# EAGLE design NuTubeAmp_1_0_1 (EAGLE 6.3)
DATABASE: ../../PARTSDB.txt

## Sheet 1 of 3
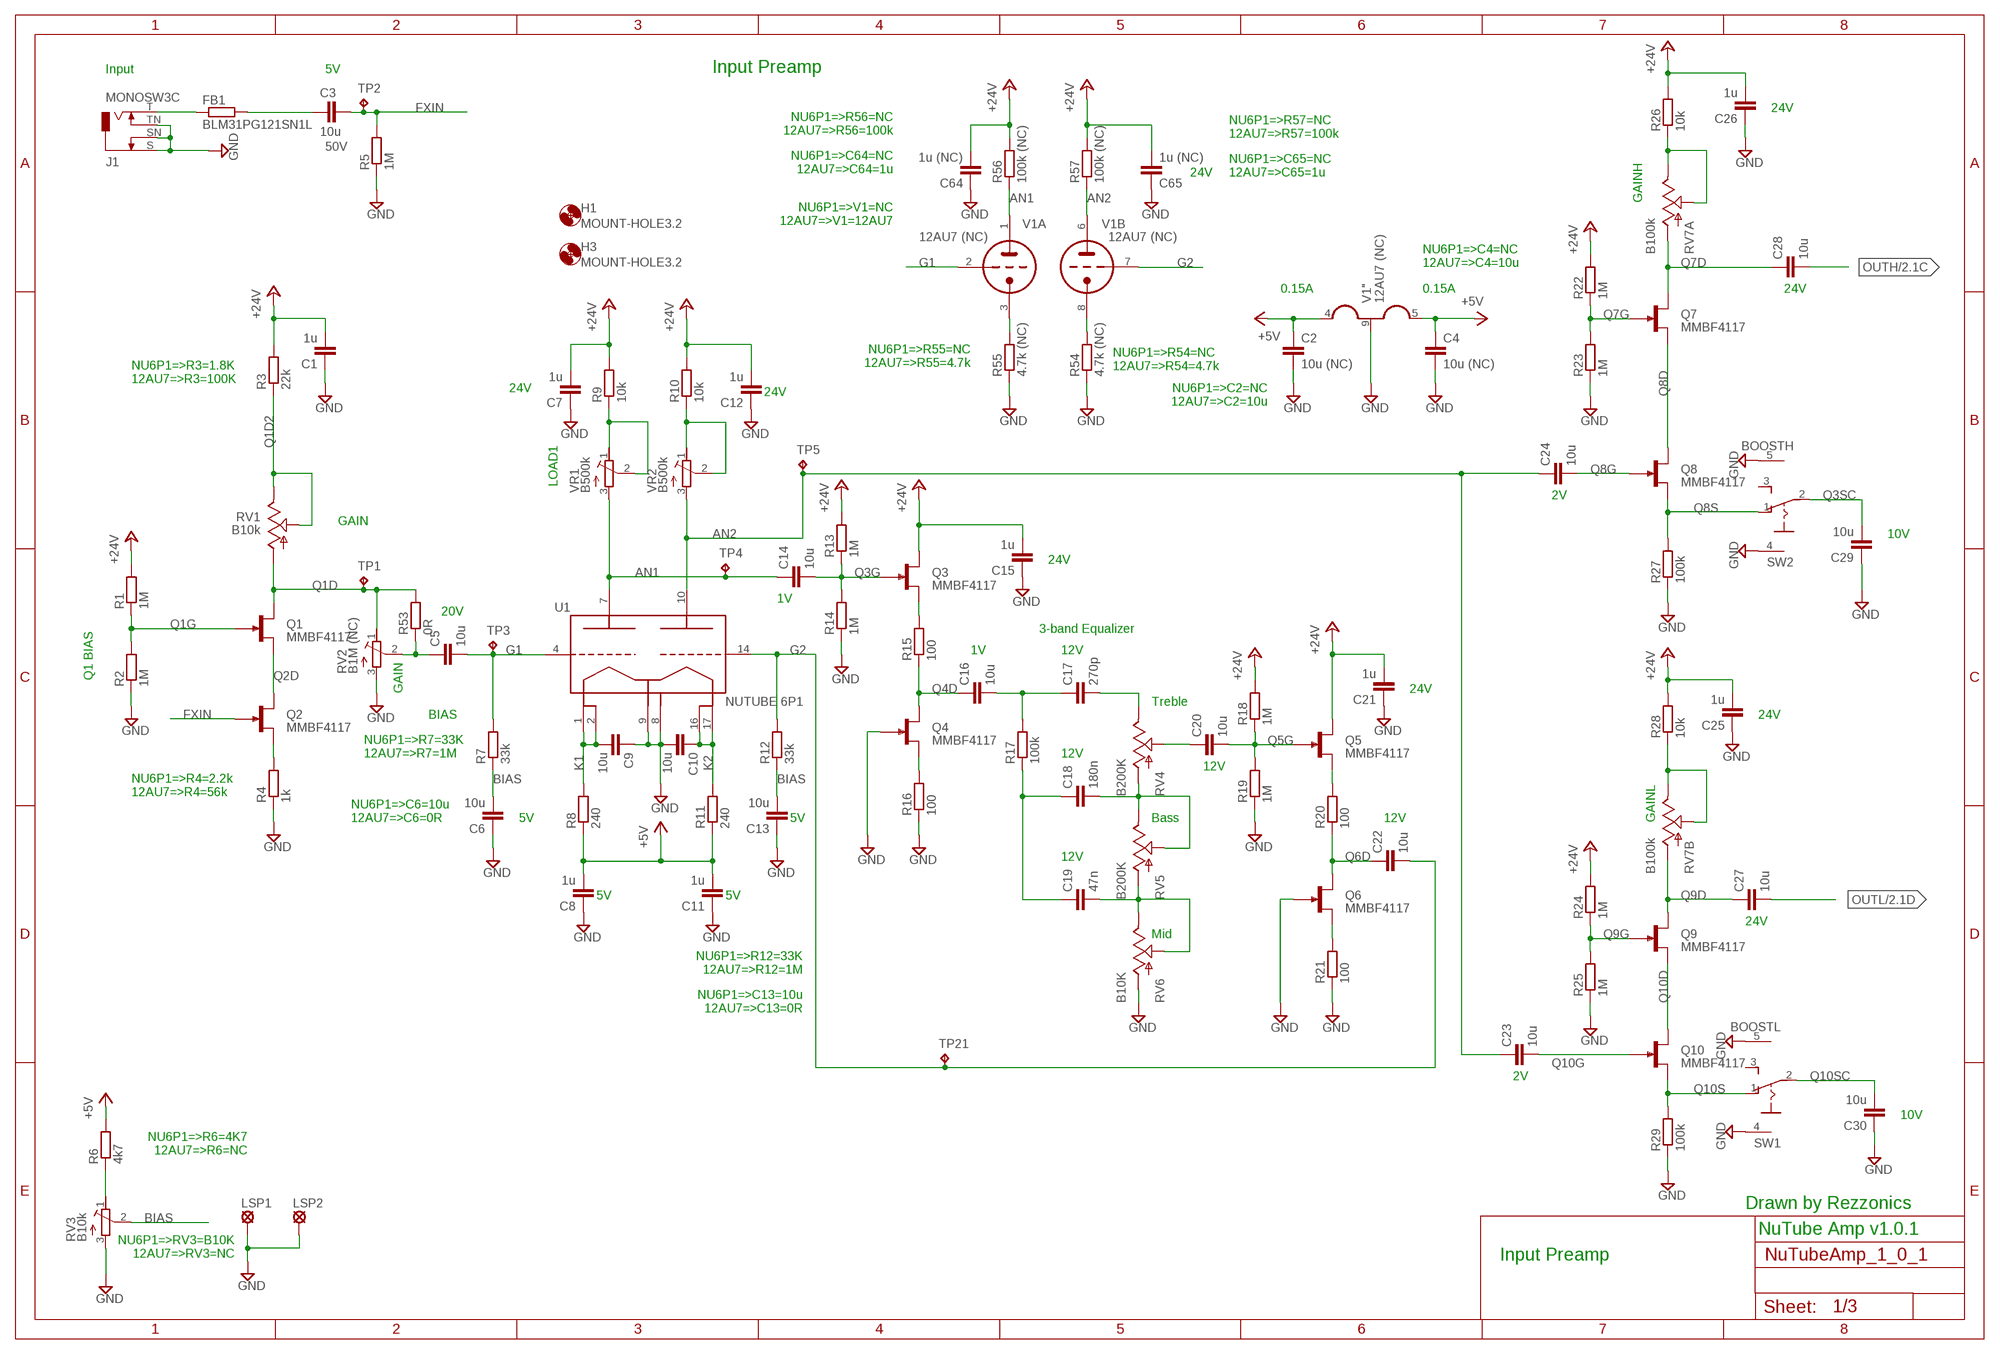
[diagram p0: schematic, sheet 1]

### Parts
C1  1u  C-EUC0603K  [C0603K]
C2  10u (NC)  C-EUC0805K  [C0805K]
C3  10u  C-EUC0805K  [C0805K]
C4  10u (NC)  C-EUC0805K  [C0805K]
C5  10u  C-EUC0805K  [C0805K]
C6  10u  C-EUC0805K  [C0805K]
C7  1u  C-EUC0603K  [C0603K]
C8  1u  C-EUC0603K  [C0603K]
C9  10u  C-EUC0805K  [C0805K]
C10  10u  C-EUC0805K  [C0805K]
C11  1u  C-EUC0603K  [C0603K]
C12  1u  C-EUC0603K  [C0603K]
C13  10u  C-EUC0805K  [C0805K]
C14  10u  C-EUC0805K  [C0805K]
C15  1u  C-EUC0603K  [C0603K]
C16  10u  C-EUC0805K  [C0805K]
C17  270p  C-EUC0402K  [C0402K]
C18  180n  C-EUC0603K  [C0603K]
C19  47n  C-EUC0402K  [C0402K]
C20  10u  C-EUC0805K  [C0805K]
C21  1u  C-EUC0603K  [C0603K]
C22  10u  C-EUC0805K  [C0805K]
C23  10u  C-EUC0805K  [C0805K]
C24  10u  C-EUC0805K  [C0805K]
C25  1u  C-EUC0603K  [C0603K]
C26  1u  C-EUC0603K  [C0603K]
C27  10u  C-EUC0805K  [C0805K]
C28  10u  C-EUC0805K  [C0805K]
C29  10u  C-EUC0805K  [C0805K]
C30  10u  C-EUC0805K  [C0805K]
C64  1u (NC)  C-EUC0603K  [C0603K]
C65  1u (NC)  C-EUC0603K  [C0603K]
FB1  BLM31PG121SN1L  R-EU_R1206  [R1206]
H1  MOUNT-HOLE3.2  [3,2]
H3  MOUNT-HOLE3.2  [3,2]
J1  MONOSW3C  [NEUTRIK-NMJ4HCD2]
LSP1  LSP13  [LSP13]
LSP2  LSP13  [LSP13]
Q1  MMBF4117  MMBF4117SOT23  [SOT23]
Q2  MMBF4117  MMBF4117SOT23  [SOT23]
Q3  MMBF4117  MMBF4117SOT23  [SOT23]
Q4  MMBF4117  MMBF4117SOT23  [SOT23]
Q5  MMBF4117  MMBF4117SOT23  [SOT23]
Q6  MMBF4117  MMBF4117SOT23  [SOT23]
Q7  MMBF4117  MMBF4117SOT23  [SOT23]
Q8  MMBF4117  MMBF4117SOT23  [SOT23]
Q9  MMBF4117  MMBF4117SOT23  [SOT23]
Q10  MMBF4117  MMBF4117SOT23  [SOT23]
R1  1M  R-EU_R0402  [R0402]
R2  1M  R-EU_R0402  [R0402]
R3  22k  R-EU_R0402  [R0402]
R4  1k  R-EU_R0402  [R0402]
R5  1M  R-EU_R0402  [R0402]
R6  4k7  R-EU_R0402  [R0402]
R7  33k  R-EU_R0402  [R0402]
R8  240  R-EU_R0603  [R0603]
R9  10k  R-EU_R0402  [R0402]
R10  10k  R-EU_R0402  [R0402]
R11  240  R-EU_R0603  [R0603]
R12  33k  R-EU_R0402  [R0402]
R13  1M  R-EU_R0402  [R0402]
R14  1M  R-EU_R0402  [R0402]
R15  100  R-EU_R0402  [R0402]
R16  100  R-EU_R0402  [R0402]
R17  100k  R-EU_R0402  [R0402]
R18  1M  R-EU_R0402  [R0402]
R19  1M  R-EU_R0402  [R0402]
R20  100  R-EU_R0402  [R0402]
R21  100  R-EU_R0402  [R0402]
R22  1M  R-EU_R0402  [R0402]
R23  1M  R-EU_R0402  [R0402]
R24  1M  R-EU_R0402  [R0402]
R25  1M  R-EU_R0402  [R0402]
R26  10k  R-EU_R0402  [R0402]
R27  100k  R-EU_R0402  [R0402]
R28  10k  R-EU_R0402  [R0402]
R29  100k  R-EU_R0402  [R0402]
R53  0R  R-EU_R0402  [R0402]
R54  4.7k (NC)  R-EU_R0402  [R0402]
R55  4.7k (NC)  R-EU_R0402  [R0402]
R56  100k (NC)  R-EU_R0402  [R0402]
R57  100k (NC)  R-EU_R0402  [R0402]
RV1  B10k  POT3310Y  [3310Y]
RV2  B1M (NC)  R-TRIMM3314G  [RTRIM3314G]
RV3  B10k  R-TRIMM3314G  [RTRIM3314G]
RV4  B200K  POT3310Y  [3310Y]
RV5  B200K  POT3310Y  [3310Y]
RV6  B10K  POT3310Y  [3310Y]
RV7  B100k  DPOT1  [3310H]
SW1  BOOSTL  SPDT  [MHS122K]
SW2  BOOSTH  SPDT  [MHS122K]
TP1  TPTP10R  [TP10R]
TP2  TPTP10R  [TP10R]
TP3  TPTP10R  [TP10R]
TP4  TPTP10R  [TP10R]
TP5  TPTP10R  [TP10R]
TP21  TPTP10R  [TP10R]
U1  NUTUBE 6P1  NUTUBE_6P1_1  [NUTUBE_6P1_1]
V1  12AU7 (NC)  12AU7-PVT9  [VT9]
VR1  B500k  R-TRIMM3314G  [RTRIM3314G]
VR2  B500k  R-TRIMM3314G  [RTRIM3314G]

### Nets
+5V [PWR]: C2.1 C4.1 C8.2 C11.2 R6.2 R8.1 R11.1 V1.4(":H1) V1.5(":H3) ; also sheet 2,3
+24V [PWR]: C1.2 C7.2 C12.2 C15.2 C21.2 C25.2 C26.2 C64.2 C65.2 Q3.1(D) Q5.1(D) R1.2 R3.2 R9.2 R10.2 R13.2 R18.2 R22.2 R24.2 R26.2 R28.2 R56.2 R57.2 ; also sheet 2,3
AN1: C14.1 R56.1 TP4.TP U1.7(A1_7) V1.1(A:TA) VR1.3(A)
AN2: C23.1 C24.1 R57.1 TP5.TP U1.10(A2_10) V1.6(B:TA) VR2.3(A)
BAST: C18.2 RV4.P$1(A) RV5.P$2(S) RV5.P$3(E)
BIAS: C6.2 C13.2 R7.1 R12.1 RV3.2(S)
EQIN: C16.2 C17.1 R17.2
EQOUT: C20.1 RV4.P$2(S)
FXIN: C3.2 Q2.2(G) R5.2 TP2.TP
G1: C5.2 R7.2 TP3.TP U1.4(G1_4) V1.2(A:TG)
G2: C22.2 R12.2 TP21.TP U1.14(G2_14) V1.7(B:TG)
G2TOP: R55.2 V1.3(A:TK)
G3TOP: R26.1 RV7.P$2(A:S) RV7.P$3(A:E)
G4TOP: R28.1 RV7.P$5(B:S) RV7.P$6(B:E)
GND [PWR]: C1.1 C2.2 C4.2 C6.1 C7.1 C8.1 C9.1 C10.2 C11.1 C12.1 C13.1 C15.1 C21.1 C25.1 C26.1 C29.1 C30.1 C64.1 C65.1 J1.S J1.SN J1.TN LSP1.MP LSP2.MP Q4.2(G) Q6.2(G) R2.1 R4.1 R5.1 R14.1 R16.1 R19.1 R21.1 R23.1 R25.1 R27.1 R29.1 R54.1 R55.1 RV2.3(A) RV3.3(A) RV6.P$1(A) SW1.4(G1) SW1.5(G2) SW2.4(G1) SW2.5(G2) U1.8(GND_8) U1.9(F2_9) V1.9(":H2) ; also sheet 2,3
GTOP: C5.1 R53.1 RV2.2(S)
K1: C9.2 R8.2 U1.1(F1_1) U1.2(F1_2)
K2: C10.1 R11.2 U1.16(F3_16) U1.17(F3_17)
MIDT: C19.2 RV5.P$1(A) RV6.P$2(S) RV6.P$3(E)
N$1: FB1.1 J1.T
N$2: C3.1 FB1.2
N$5: Q3.3(S) R15.2
N$21: R6.1 RV3.1(E)
N$22: R54.2 V1.8(B:TK)
N$29: C18.1 C19.1 R17.1
OUTH: C28.2 ; also sheet 2
OUTL: C27.2 ; also sheet 2
Q1D: Q1.1(D) R53.2 RV1.P$1(A) RV2.1(E) TP1.TP
Q1D2: R3.1 RV1.P$2(S) RV1.P$3(E)
Q1G: Q1.2(G) R1.1 R2.2
Q1S: Q2.3(S) R4.2
Q1S1: Q4.3(S) R16.2
Q1S2: Q6.3(S) R21.2
Q2D: Q1.3(S) Q2.1(D)
Q3G: C14.2 Q3.2(G) R13.1 R14.2
Q3SC: C29.2 SW2.2(P)
Q4D: C16.1 Q4.1(D) R15.1
Q5G: C20.2 Q5.2(G) R18.1 R19.2
Q5S: Q5.3(S) R20.2
Q6D: C22.1 Q6.1(D) R20.1
Q7D: C28.1 Q7.1(D) RV7.P$1(A:A)
Q7G: Q7.2(G) R22.1 R23.2
Q8D: Q7.3(S) Q8.1(D)
Q8G: C24.2 Q8.2(G)
Q8S: Q8.3(S) R27.2 SW2.1(O)
Q9D: C27.1 Q9.1(D) RV7.P$4(B:A)
Q9G: Q9.2(G) R24.1 R25.2
Q10D: Q9.3(S) Q10.1(D)
Q10G: C23.2 Q10.2(G)
Q10S: Q10.3(S) R29.2 SW1.1(O)
Q10SC: C30.2 SW1.2(P)
RL1: R9.1 VR1.1(E) VR1.2(S)
RL2: R10.1 VR2.1(E) VR2.2(S)
TBT: C17.2 RV4.P$3(E)
Unconnected: SW1.3(S) SW2.3(S)

### Notes on the sheet
- Input | 5V | Input Preamp
- NU6P1=>R56=NC
  12AU7=>R56=100k
- 24V
- NU6P1=>R57=NC
  12AU7=>R57=100k
- NU6P1=>C64=NC
  12AU7=>C64=1u
- 24V
- NU6P1=>C65=NC
  12AU7=>C65=1u
- NU6P1=>V1=NC
  12AU7=>V1=12AU7
- GAINH
- NU6P1=>C4=NC
  12AU7=>C4=10u
- 0.15A | 0.15A | 24V
- NU6P1=>R55=NC
  12AU7=>R55=4.7k
- NU6P1=>R54=NC
  12AU7=>R54=4.7k
- NU6P1=>R3=1.8K
  12AU7=>R3=100K
- 24V
- NU6P1=>C2=NC
  12AU7=>C2=10u
- 24V
- LOAD1
- 2V
- GAIN
- 10V
- 24V
- 1V
- 20V
- 3-band Equalizer
- 1V | 12V
- Q1 BIAS
- GAIN | 24V
- Treble
- BIAS | 24V
- NU6P1=>R7=33K
  12AU7=>R7=1M
- 12V
- 12V
- NU6P1=>R4=2.2k
  12AU7=>R4=56k
- NU6P1=>C6=10u
  12AU7=>C6=0R
- 5V | 5V | Bass | 12V | GAINL
- 12V
- 5V | 5V
- 24V
- Mid
- NU6P1=>R12=33K
  12AU7=>R12=1M
- NU6P1=>C13=10u
  12AU7=>C13=0R
- 2V
- 10V
- NU6P1=>R6=4K7
  12AU7=>R6=NC
- Drawn by Rezzonics
- NU6P1=>RV3=B10K
  12AU7=>RV3=NC
- NuTube Amp v1.0.1
- Input Preamp

## Sheet 2 of 3
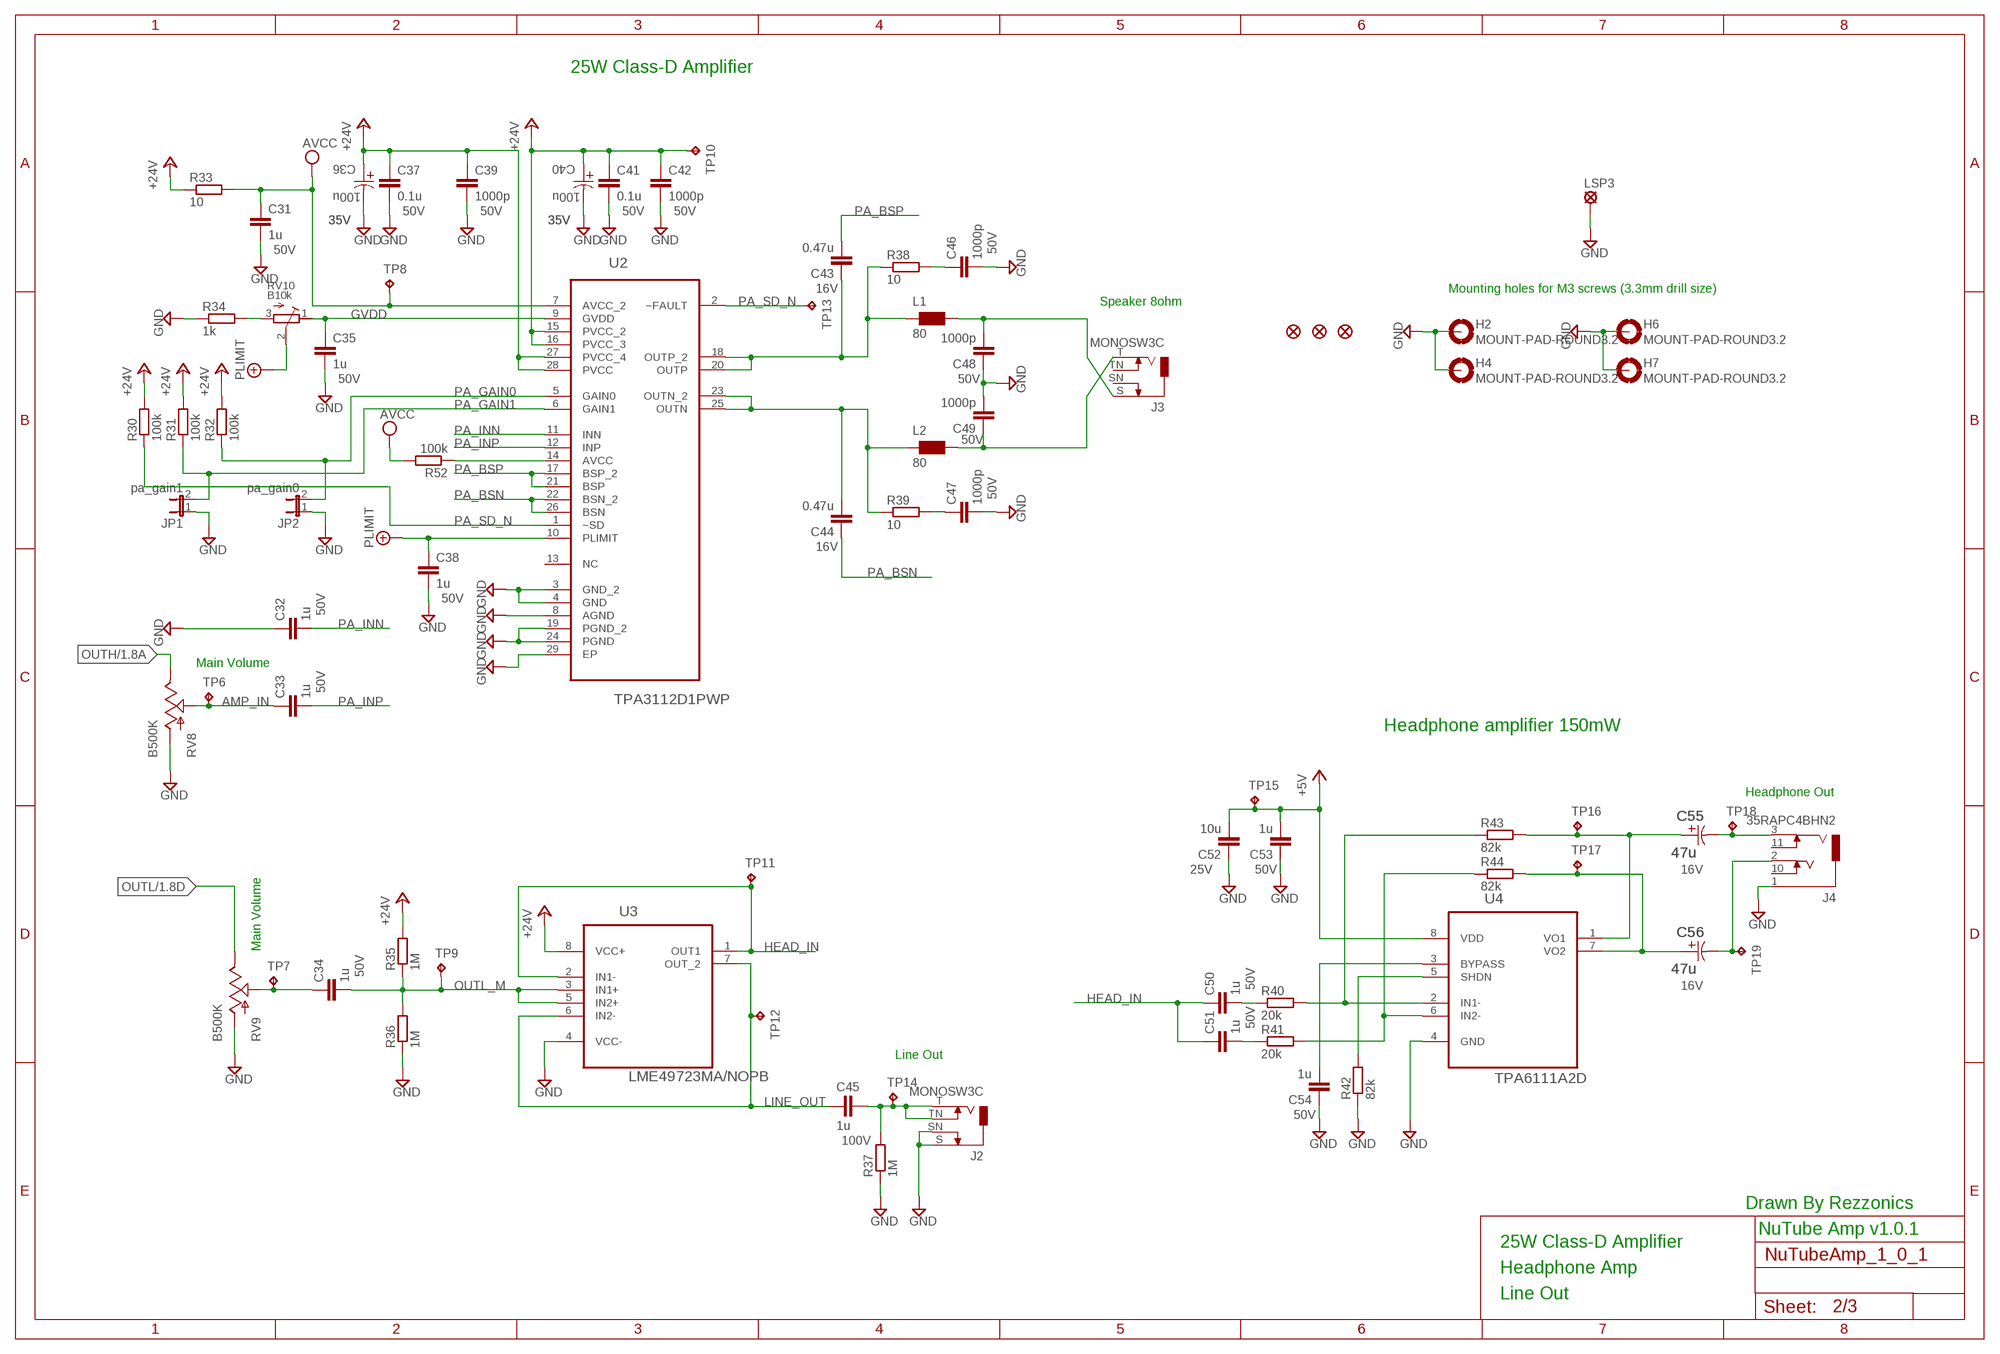
[diagram p1: schematic, sheet 2]

### Parts
C31  1u  C-EUC0603K  [C0603K]
C32  1u  C-EUC0603K  [C0603K]
C33  1u  C-EUC0603K  [C0603K]
C34  1u  C-EUC0603K  [C0603K]
C35  1u  C-EUC0603K  [C0603K]
C36  100u  EEE-HAE101XAP-CASE-D8  [CAPAE660X800N]
C37  0.1u  C-EUC0603K  [C0603K]
C38  1u  C-EUC0603K  [C0603K]
C39  1000p  C-EUC0603K  [C0603K]
C40  100u  EEE-HAE101XAP-CASE-D8  [CAPAE660X800N]
C41  0.1u  C-EUC0603K  [C0603K]
C42  1000p  C-EUC0603K  [C0603K]
C43  0.47u  C-EUC0603K  [C0603K]
C44  0.47u  C-EUC0603K  [C0603K]
C45  1u  C-EUC0603K  [C0603K]
C46  1000p  C-EUC0603K  [C0603K]
C47  1000p  C-EUC0603K  [C0603K]
C48  1000p  C-EUC0603K  [C0603K]
C49  1000p  C-EUC0603K  [C0603K]
C50  1u  C-EUC0603K  [C0603K]
C51  1u  C-EUC0603K  [C0603K]
C52  10u  C-EUC0805K  [C0805K]
C53  1u  C-EUC0603K  [C0603K]
C54  1u  C-EUC0603K  [C0603K]
C55  47u  EEE-HBC470UAR-CASE-C  [CAPAE530X610N]
C56  47u  EEE-HBC470UAR-CASE-C  [CAPAE530X610N]
H2  MOUNT-PAD-ROUND3.2  [3,2-PAD]
H4  MOUNT-PAD-ROUND3.2  [3,2-PAD]
H6  MOUNT-PAD-ROUND3.2  [3,2-PAD]
H7  MOUNT-PAD-ROUND3.2  [3,2-PAD]
J2  MONOSW3C  [NEUTRIK-NMJ4HCD2]
J3  MONOSW3C  [NEUTRIK-NMJ4HCD2]
J4  35RAPC4BHN2  [35RAPC4BHN2]
JP1  pa_gain1  JUMPER-2PTH  [1X02]
JP2  pa_gain0  JUMPER-2PTH  [1X02]
JP3  FIDUCIAL1X2.5  [FIDUCIAL-1X2.5]
JP4  FIDUCIAL1X2.5  [FIDUCIAL-1X2.5]
JP5  FIDUCIAL1X2.5  [FIDUCIAL-1X2.5]
L1  80  WE-CBF_0805  [0805]
L2  80  WE-CBF_0805  [0805]
LSP3  LSP13  [LSP13]
R30  100k  R-EU_R0603  [R0603]
R31  100k  R-EU_R0603  [R0603]
R32  100k  R-EU_R0603  [R0603]
R33  10  R-EU_R0603  [R0603]
R34  1k  R-EU_R0603  [R0603]
R35  1M  R-EU_R0402  [R0402]
R36  1M  R-EU_R0402  [R0402]
R37  1M  R-EU_R0402  [R0402]
R38  10  R-EU_R0603  [R0603]
R39  10  R-EU_R0603  [R0603]
R40  20k  R-EU_R0603  [R0603]
R41  20k  R-EU_R0603  [R0603]
R42  82k  R-EU_R0603  [R0603]
R43  82k  R-EU_R0603  [R0603]
R44  82k  R-EU_R0603  [R0603]
R52  100k  R-EU_R0603  [R0603]
RV8  B500K  POT3310Y  [3310Y]
RV9  B500K  POT3310Y  [3310Y]
RV10  B10k  R-TRIMM3314G  [RTRIM3314G]
TP6  TPTP10R  [TP10R]
TP7  TPTP10R  [TP10R]
TP8  TPTP10R  [TP10R]
TP9  TPTP10R  [TP10R]
TP10  TPTP10R  [TP10R]
TP11  TPTP10R  [TP10R]
TP12  TPTP10R  [TP10R]
TP13  TPTP10R  [TP10R]
TP14  TPTP10R  [TP10R]
TP15  TPTP10R  [TP10R]
TP16  TPTP10R  [TP10R]
TP17  TPTP10R  [TP10R]
TP18  TPTP10R  [TP10R]
TP19  TPTP10R  [TP10R]
U2  TPA3112D1PWP  [SOP65P640X120-29N]
U3  LME49723MA/NOPB  TL972ID  [SOIC127P600X175-8N]
U4  TPA6111A2D  [SOIC127P600X175-8N]

### Nets
+5V [PWR]: C52.2 C53.2 TP15.TP U4.8(VDD) ; also sheet 1,3
+24V [PWR]: C36.1 C37.1 C39.1 C40.1 C41.1 C42.1 R30.2 R31.2 R32.2 R33.1 R35.2 TP10.TP U2.15(PVCC_2) U2.16(PVCC_3) U2.27(PVCC_4) U2.28(PVCC) U3.8(VCC+) ; also sheet 1,3
+UB [PWR]: C38.1 RV10.2(S) U2.10(PLIMIT) ; supply symbol labelled PLIMIT
AMP_IN: C33.1 RV8.P$2(S) TP6.TP
GND [PWR]: C31.2 C32.1 C35.2 C36.2 C37.2 C38.2 C39.2 C40.2 C41.2 C42.2 C46.2 C47.2 C48.1 C49.2 C52.1 C53.1 C54.1 H2.B3,2(MOUNT) H4.B3,2(MOUNT) H6.B3,2(MOUNT) H7.B3,2(MOUNT) J2.S J2.SN J4.1(S) JP1.1 JP2.1 LSP3.MP R34.1 R36.1 R37.1 R42.1 RV8.P$1(A) RV9.P$1(A) U2.3(GND_2) U2.4(GND) U2.8(AGND) U2.19(PGND_2) U2.24(PGND) U2.29(EP) U3.4(VCC-) U4.4(GND) ; also sheet 1,3
GVDD [PWR]: C35.1 RV10.1(E) U2.9(GVDD)
HEAD_IN: C50.1 C51.1 TP11.TP U3.1(OUT1) U3.2(IN1-)
LINE_OUT: C45.1 TP12.TP U3.6(IN2-) U3.7(OUT_2)
N$3: R40.2 R43.1 U4.2(IN1-)
N$8: R52.1 U2.14(AVCC)
N$10: R41.2 R44.1 U4.6(IN2-)
N$12: C55.1 R43.2 TP16.TP U4.1(VO1)
N$13: C34.1 RV9.P$2(S) TP7.TP
N$14: C56.1 R44.2 TP17.TP U4.7(VO2)
N$15: C50.2 R40.1
N$16: C51.2 R41.1
N$17: C54.2 U4.3(BYPASS)
N$18: R42.2 U4.5(SHDN)
N$19: C55.2 J4.3(R) TP18.TP
N$20: C56.2 J4.2(T) TP19.TP
N$64: C45.2 J2.T J2.TN R37.2 TP14.TP
N$65: C46.1 R38.2
N$66: C47.1 R39.2
N$67: R34.2 RV10.3(A)
N$68: C49.1 J3.T L2.2
N$70: C48.2 J3.S L1.2
N$71: C43.1 L1.1 R38.1 U2.18(OUTP_2) U2.20(OUTP)
N$72: C44.2 L2.1 R39.1 U2.23(OUTN_2) U2.25(OUTN)
OUTH: RV8.P$3(E) ; also sheet 1
OUTL: RV9.P$3(E) ; also sheet 1
OUTL_M: C34.2 R35.1 R36.2 TP9.TP U3.3(IN1+) U3.5(IN2+)
PA_BSN: C44.1 U2.22(BSN_2) U2.26(BSN)
PA_BSP: C43.2 U2.17(BSP_2) U2.21(BSP)
PA_GAIN0: JP2.2 R32.1 U2.5(GAIN0)
PA_GAIN1: JP1.2 R31.1 U2.6(GAIN1)
PA_INN: C32.2 U2.11(INN)
PA_INP: C33.2 U2.12(INP)
PA_SD_N: R30.1 TP13.TP U2.1(~SD) U2.2(~FAULT)
VCC: C31.1 R33.2 R52.2 TP8.TP U2.7(AVCC_2) ; supply symbol labelled AVCC
Unconnected: J3.SN J3.TN J4.10(TN) J4.11(RN) U2.13(NC)

### Notes on the sheet
- 25W Class-D Amplifier
- Mounting holes for M3 screws (3.3mm drill size)
- Speaker 8ohm
- Main Volume
- Headphone amplifier 150mW
- Headphone Out
- Main Volume
- Line Out
- Drawn By Rezzonics
- NuTube Amp v1.0.1
- 25W Class-D Amplifier
- Headphone Amp
- Line Out

## Sheet 3 of 3
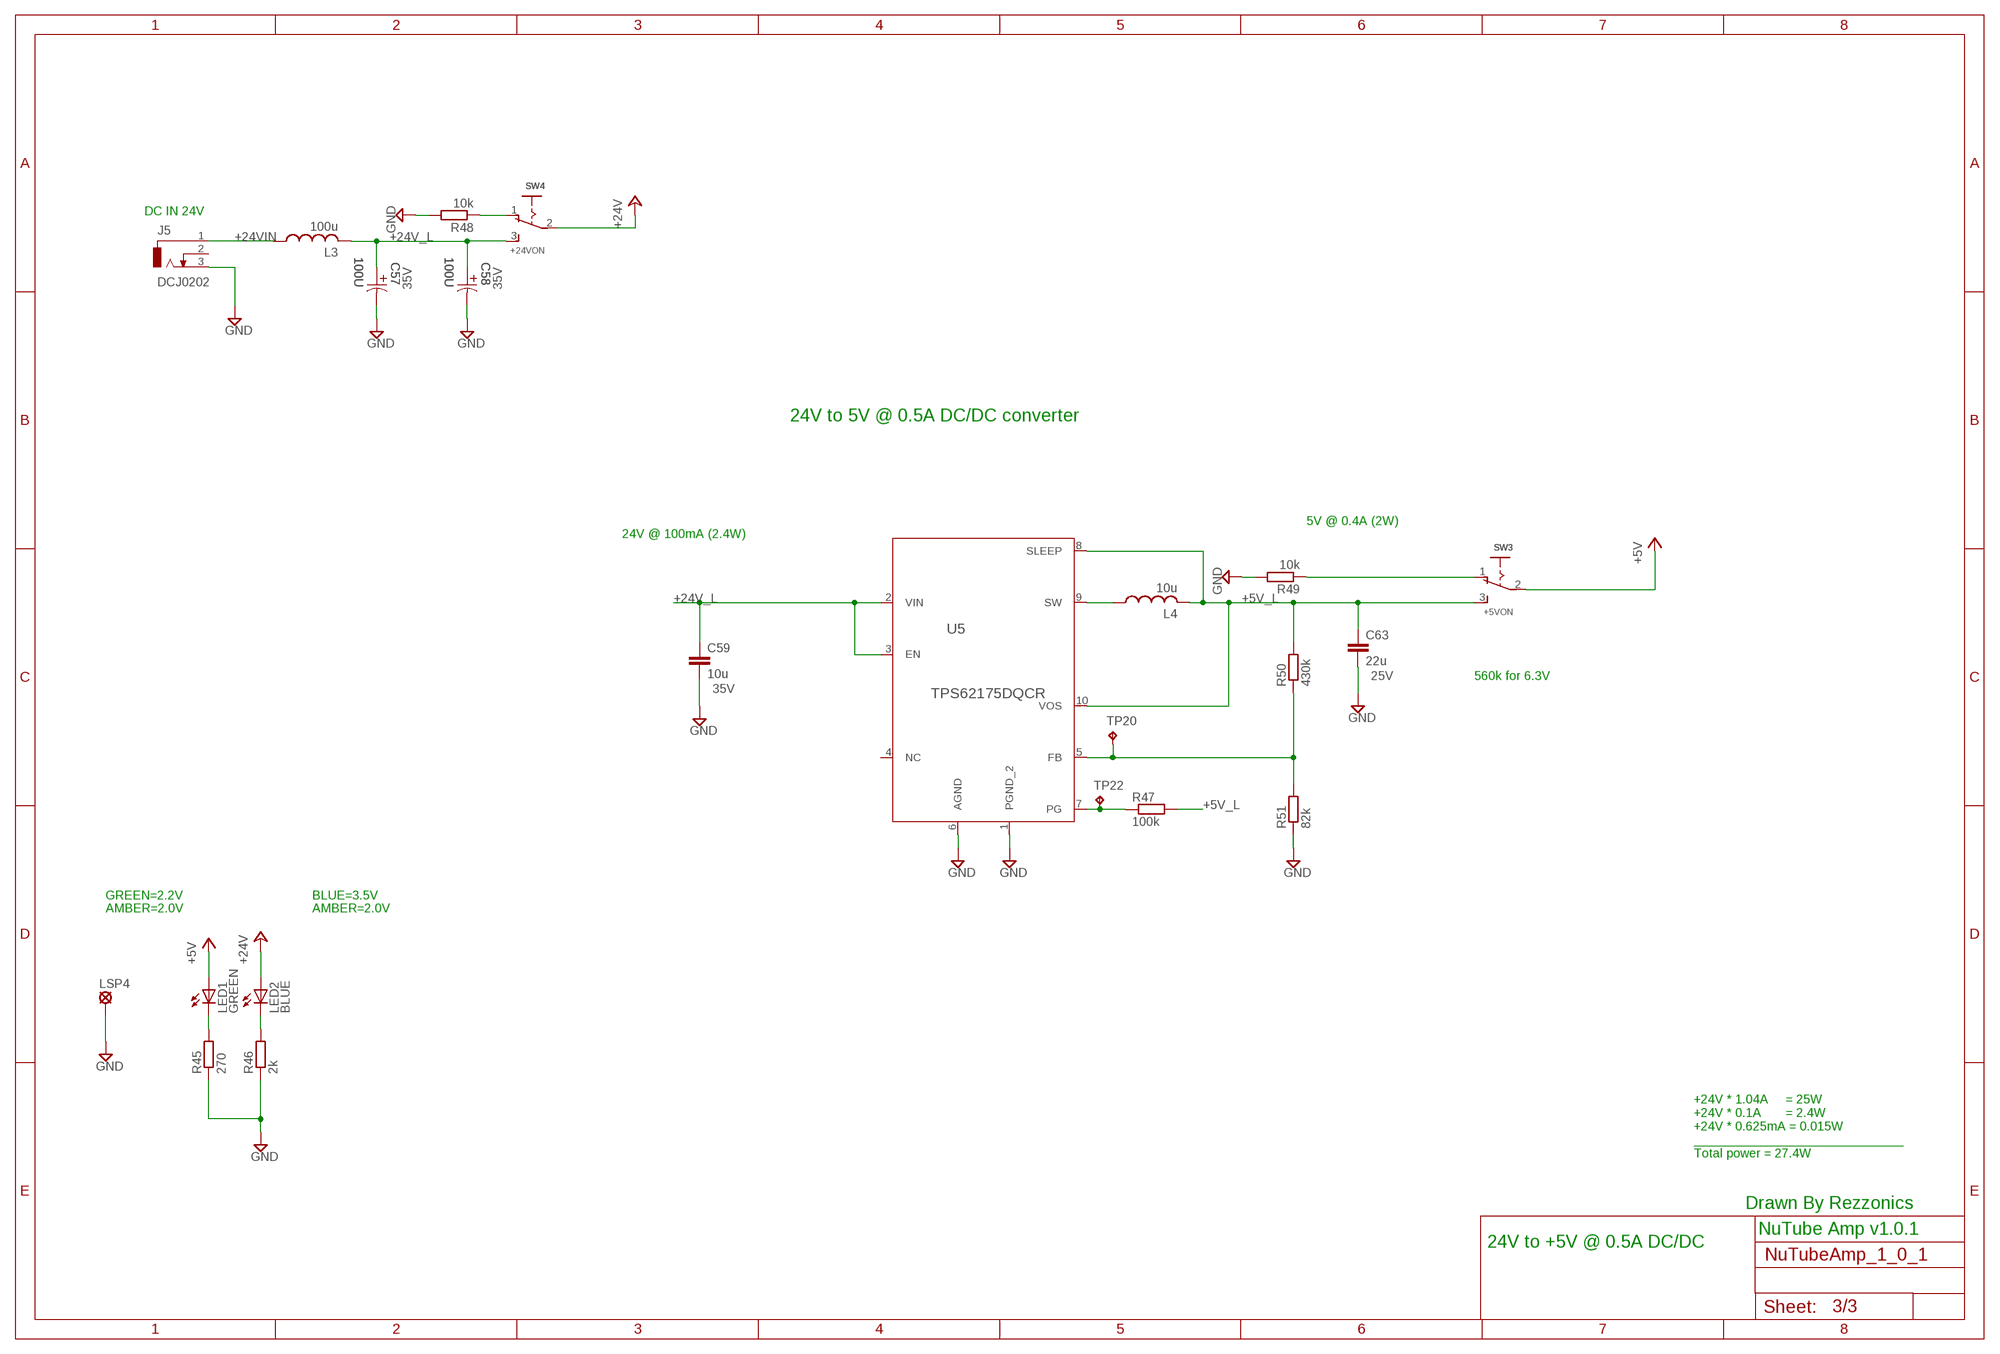
[diagram p2: schematic, sheet 3]

### Parts
C57  100U  EEE-HAV101XAP-CASE-D8  [CAPAE660X800N]
C58  100U  EEE-HAV101XAP-CASE-D8  [CAPAE660X800N]
C59  10u  C-EUC0805K  [C0805K]
C63  22u  C-EUC0805K  [C0805K]
J5  DCJ0202  [DCJ0202]
L3  100u  SRN1060  [SRN1060]
L4  10u  SRN4018  [SRN4018]
LED1  GREEN  LED5MM  [LED5MM]
LED2  BLUE  LED5MM  [LED5MM]
LSP4  LSP13  [LSP13]
R45  270  R-EU_R0603  [R0603]
R46  2k  R-EU_R0603  [R0603]
R47  100k  R-EU_R0402  [R0402]
R48  10k  R-EU_R0603  [R0603]
R49  10k  R-EU_R0603  [R0603]
R50  430k  R-EU_R0402  [R0402]
R51  82k  R-EU_R0402  [R0402]
SW3  +5VON  SPDT1G  [GH39P0]
SW4  +24VON  SPDT1G  [GH39P0]
TP20  TPTP10R  [TP10R]
TP22  TPTP10R  [TP10R]
U5  TPS62175DQCR  [R-PWSON-N10]

### Nets
+5V [PWR]: LED1.A SW3.2(P) ; also sheet 1,2
+5V_L [PWR]: C63.1 L4.2 R47.2 R50.2 SW3.3(S) U5.8(SLEEP) U5.10(VOS)
+24V [PWR]: LED2.A SW4.2(P) ; also sheet 1,2
+24V_L [PWR]: C57.1 C58.1 C59.1 L3.2 SW4.3(S) U5.2(VIN) U5.3(EN)
+24VIN: J5.1 L3.1
GND [PWR]: C57.2 C58.2 C59.2 C63.2 J5.3 LSP4.MP R45.1 R46.1 R48.2 R49.2 R51.1 U5.1(PGND_2) U5.6(AGND) ; also sheet 1,2
N$4: R47.1 TP22.TP U5.7(PG)
N$6: R48.1 SW4.1(O)
N$7: R49.1 SW3.1(O)
N$23 [PWR]: L4.1 U5.9(SW)
N$90: LED1.K(C) R45.2
N$102: LED2.K(C) R46.2
VCC3: R50.1 R51.2 TP20.TP U5.5(FB)
Unconnected: J5.2 U5.4(NC)

### Notes on the sheet
- DC IN 24V
- 24V to 5V @ 0.5A DC/DC converter
- 5V @ 0.4A (2W)
- 24V @ 100mA (2.4W)
- 560k for 6.3V
- GREEN=2.2V | BLUE=3.5V
- AMBER=2.0V | AMBER=2.0V
- +24V * 1.04A     = 25W
  +24V * 0.1A       = 2.4W
  +24V * 0.625mA = 0.015W
  ____________________________
  Total power = 27.4W
- Drawn By Rezzonics
- NuTube Amp v1.0.1
- 24V to +5V @ 0.5A DC/DC

## Library data of the parts
C1 C7 C8 C11 C12 C15 C21 C25 C26 C64 C65 = rcl:C-EU: CAPACITOR, European symbol; MPN: C1608X5R1H105K080AB
C2 C4-C6 C9 C10 C13 C14 C16 C20 C22-C24 C27-C30 = rcl:C-EU: CAPACITOR, European symbol; MPN: GRM21BR6YA106KE43L
C3 = rcl:C-EU: CAPACITOR, European symbol; MPN: GRM21BR6YA106KE43L; VOLT: 50V
C17 = rcl:C-EU: CAPACITOR, European symbol; MPN: GRM1555C1H271JA01D; VOLT: 50V
C18 = rcl:C-EU: CAPACITOR, European symbol; MPN: GRM188R71C184KA01D; VOLT: 16V
C19 = rcl:C-EU: CAPACITOR, European symbol; MPN: GRM155R71H473KE14D; VOLT: 16V
C31-C35 C38 C50 C51 C53 C54 = rcl:C-EU: CAPACITOR, European symbol; MPN: C1608X5R1H105K080AB; VOLT: 50V
C36 C40 = Panasonic-EEE-EEV-EEF-ECQ:EEE-: Aluminum Electrolytic Capacitors,Surface Mount Type; MPN: EEE-1VA101XP; OC_FARNELL: 2284687; OC_MOUSER: 667-EEE-1VA101XP; OC_NEWARK: 53W3698; SUPPLIER: PANASONIC; TOLERANCE: ±20 %; VALUE: 100UF; VOLT: 35V; VOLTAGERATING: 35V
C37 C41 = rcl:C-EU: CAPACITOR, European symbol; MPN: GRM188R71H104KA93D; VOLT: 50V
C39 C42 C46-C49 = rcl:C-EU: CAPACITOR, European symbol; MPN: GRM1885C1H102FA01D; VOLT: 50V
C43 C44 = rcl:C-EU: CAPACITOR, European symbol; MPN: GRM188R71C474KA88D; VOLT: 16V
C45 = rcl:C-EU: CAPACITOR, European symbol; MPN: C1608X5R1H105K080AB; VOLT: 100V
C52 = rcl:C-EU: CAPACITOR, European symbol; MPN: GRM21BR6YA106KE43L; VOLT: 25V
C55 C56 = Panasonic-EEE-EEV-EEF-ECQ:EEE-: Aluminum Electrolytic Capacitors,Surface Mount Type; MPN: EEE-HBC470UAR; OC_FARNELL: 2284699; OC_NEWARK: 53W3709; RATEDVOLTAGE: 16V; SUPPLIER: PANASONIC; TOLERANCE: ±20 %; VALUE: 47UF; VOLT: 16V
C57 C58 = Panasonic-EEE-EEV-EEF-ECQ:EEE-: Aluminum Electrolytic Capacitors,Surface Mount Type; MPN: EEE-1VA101XP; OC_FARNELL: 2284690; OC_NEWARK: 53W3701; SUPPLIER: PANASONIC; TOLERANCE: ±20 %; VALUE: 100UF; VOLTAGERATING: 35V
C59 = rcl:C-EU: CAPACITOR, European symbol; MPN: GRM21BR6YA106KE43L; VOLT: 35V
C63 = rcl:C-EU: CAPACITOR, European symbol; MPN: C2012X5R1V226M125AC; VOLT: 25V
FB1 = rcl:R-EU_: RESISTOR, European symbol; MPN: BLM31PG121SN1L
H1 H3 = holes:MOUNT-HOLE: MOUNTING HOLE with drill center marker; MPN: *
H2 H4 H6 H7 = holes:MOUNT-PAD-ROUND: MOUNTING PAD, round; MPN: *
J1-J3 = audio jacks 0.25 inch:MONOSW3C: 1/4" mono jack, switched, with chrome ferrule and straight PCB pins, mounting nut included; MPN: NMJ4HCD2
J4 = audio jacks 3.5mm:35RAPC4BHN2: 3.5MM PC horizontal mount Jack, stereo, non-threaded bushing PN#: Switchcraft 35RAPC4BHN2 Mouser PN# 502-35RAPC4BHN2; MPN: 35RAPC4BHN2
J5 = con-jack:DCJ0202: DC POWER JACK Source: DCJ0202.pdf; MPN: PJ-202A; OC_FARNELL: unknown; OC_NEWARK: unknown
JP1 JP2 = SparkFun:JUMPER-2: Jumper Basic 0.1" spaced jumper. Use with breakaway headers.; MPN: 77311-401-36LF
JP3-JP5 = SparkFun:FIDUCIAL: Fiducial Alignment Points Various fiducial points for machine vision alignment.; MPN: *
L1 L2 = wuerth-elektronik:WE-CBF: SMD EMI Suppression Ferrite Beads - excellent anti-EMI properties - low DCR - impedances till 3000 ohms - rated current up to 6 A; MPN: HI0805R800R-10
L3 = rezzonics:SRN1060: SRN10160 <http://www.bourns.com/docs/Product-Datasheets/SRN1060.pdf>; MPN: SRN1060-101M
L4 = rezzonics:SRN4018: SRN4018 <http://www.bourns.com/docs/Product-Datasheets/SRN4018.pdf>; MPN: SRN4018-100M
LED1 = led:LED: LED OSRAM: - CHIPLED LG R971, LG N971, LY N971, LG Q971, LY Q971, LO R971, LY R971 LH N974, LH R974 LS Q976, LO Q976, LY Q976 LO Q996 - Hyper CHIPLED LW Q18S LB Q993, LB Q99A, LB R99A - SideLED LS A670, LO A670, LY A670, LG A670, LP A670 LB A673, LV A673, LT A673, LW A673 LH A674 LY A675 LS A676, LA A676, LO A676, LY A676, LW A676 LS A679, LY A679, LG A679 - Hyper Micro SIDELED® LS Y876, LA Y876, LO Y876, LY Y876 LT Y87S - SmartLED LW L88C, LW L88S LB L89C, LB L89S, LG L890 LS L89K, LO L89K, LY L89K LS L896, LA L896, LO L896, LY L896 - TOPLED LS T670, LO T670, LY T670, LG T670, LP T670 LSG T670, LSP T670, LSY T670, LOP T670, LYG T670 LG T671, LOG T671, LSG T671 LB T673, LV T673, LT T673, LW T673 LH T674 LS T676, LA T676, LO T676, LY T676, LB T676, LH T676, LSB T676, LW T676 LB T67C, LV T67C, LT T67C, LS T67K, LO T67K, LY T67K, LW E67C LS E67B, LA E67B, LO E67B, LY E67B, LB E67C, LV E67C, LT E67C LW T67C LS T679, LY T679, LG T679 LS T770, LO T770, LY T770, LG T770, LP T770 LB T773, LV T773, LT T773, LW T773 LH T774 LS E675, LA E675, LY E675, LS T675 LS T776, LA T776, LO T776, LY T776, LB T776 LHGB T686 LT T68C, LB T68C - Hyper Mini TOPLED® LB M676 - Mini TOPLED Santana® LG M470 LS M47K, LO M47K, LY M47K Source: http://www.osram.convergy.de LUXEON: - LUMILED® LXK2-PW12-R00, LXK2-PW12-S00, LXK2-PW14-U00, LXK2-PW14-V00 LXK2-PM12-R00, LXK2-PM12-S00, LXK2-PM14-U00 LXK2-PE12-Q00, LXK2-PE12-R00, LXK2-PE12-S00, LXK2-PE14-T00, LXK2-PE14-U00 LXK2-PB12-K00, LXK2-PB12-L00, LXK2-PB12-M00, LXK2-PB14-N00, LXK2-PB14-P00, LXK2-PB14-Q00 LXK2-PR12-L00, LXK2-PR12-M00, LXK2-PR14-Q00, LXK2-PR14-R00 LXK2-PD12-Q00, LXK2-PD12-R00, LXK2-PD12-S00 LXK2-PH12-R00, LXK2-PH12-S00 LXK2-PL12-P00, LXK2-PL12-Q00, LXK2-PL12-R00 Source: www.luxeon.com KINGBRIGHT: KA-3528ASYC Source: www.kingbright.com; MPN: SSL-LX5093GD
LED2 = led:LED: LED OSRAM: - CHIPLED LG R971, LG N971, LY N971, LG Q971, LY Q971, LO R971, LY R971 LH N974, LH R974 LS Q976, LO Q976, LY Q976 LO Q996 - Hyper CHIPLED LW Q18S LB Q993, LB Q99A, LB R99A - SideLED LS A670, LO A670, LY A670, LG A670, LP A670 LB A673, LV A673, LT A673, LW A673 LH A674 LY A675 LS A676, LA A676, LO A676, LY A676, LW A676 LS A679, LY A679, LG A679 - Hyper Micro SIDELED® LS Y876, LA Y876, LO Y876, LY Y876 LT Y87S - SmartLED LW L88C, LW L88S LB L89C, LB L89S, LG L890 LS L89K, LO L89K, LY L89K LS L896, LA L896, LO L896, LY L896 - TOPLED LS T670, LO T670, LY T670, LG T670, LP T670 LSG T670, LSP T670, LSY T670, LOP T670, LYG T670 LG T671, LOG T671, LSG T671 LB T673, LV T673, LT T673, LW T673 LH T674 LS T676, LA T676, LO T676, LY T676, LB T676, LH T676, LSB T676, LW T676 LB T67C, LV T67C, LT T67C, LS T67K, LO T67K, LY T67K, LW E67C LS E67B, LA E67B, LO E67B, LY E67B, LB E67C, LV E67C, LT E67C LW T67C LS T679, LY T679, LG T679 LS T770, LO T770, LY T770, LG T770, LP T770 LB T773, LV T773, LT T773, LW T773 LH T774 LS E675, LA E675, LY E675, LS T675 LS T776, LA T776, LO T776, LY T776, LB T776 LHGB T686 LT T68C, LB T68C - Hyper Mini TOPLED® LB M676 - Mini TOPLED Santana® LG M470 LS M47K, LO M47K, LY M47K Source: http://www.osram.convergy.de LUXEON: - LUMILED® LXK2-PW12-R00, LXK2-PW12-S00, LXK2-PW14-U00, LXK2-PW14-V00 LXK2-PM12-R00, LXK2-PM12-S00, LXK2-PM14-U00 LXK2-PE12-Q00, LXK2-PE12-R00, LXK2-PE12-S00, LXK2-PE14-T00, LXK2-PE14-U00 LXK2-PB12-K00, LXK2-PB12-L00, LXK2-PB12-M00, LXK2-PB14-N00, LXK2-PB14-P00, LXK2-PB14-Q00 LXK2-PR12-L00, LXK2-PR12-M00, LXK2-PR14-Q00, LXK2-PR14-R00 LXK2-PD12-Q00, LXK2-PD12-R00, LXK2-PD12-S00 LXK2-PH12-R00, LXK2-PH12-S00 LXK2-PL12-P00, LXK2-PL12-Q00, LXK2-PL12-R00 Source: www.luxeon.com KINGBRIGHT: KA-3528ASYC Source: www.kingbright.com; MPN: SSL-LX5093USBD
LSP1-LSP4 = solpad:LSP13: SOLDER PAD drill 1.3 mm, distributor Buerklin, 12H562; MPN: 1249
Q1-Q10 = rezzonics:MMBF4117: N-CHANNEL FET MMBF4117 <https://www.fairchildsemi.com/datasheets/MM/MMBF4117.pdf>; MPN: MMBF4117
R1 R2 R5 R13 R14 R18 R19 R22-R25 R35-R37 = resistor:R-EU_: RESISTOR, European symbol; MPN: ERJ-2RKF1004X
R3 = resistor:R-EU_: RESISTOR, European symbol; MPN: ERJ-2RKF1801X
R4 = resistor:R-EU_: RESISTOR, European symbol; MPN: ERJ-2RKF2201X
R6 R54 R55 = resistor:R-EU_: RESISTOR, European symbol; MPN: ERJ-2RKF4701X
R7 R12 = resistor:R-EU_: RESISTOR, European symbol; MPN: ERJ-2RKF3302X
R8 R11 = rcl:R-EU_: RESISTOR, European symbol; MPN: ERJ-3EKF2400V
R9 R10 R26 R28 = resistor:R-EU_: RESISTOR, European symbol; MPN: ERJ-2RKF1002X
R15 R16 R20 R21 = resistor:R-EU_: RESISTOR, European symbol; MPN: ERJ-2RKF1000X
R17 R27 R29 R47 R56 R57 = resistor:R-EU_: RESISTOR, European symbol; MPN: ERJ-2RKF1003X
R30-R32 R52 = rcl:R-EU_: RESISTOR, European symbol; MPN: ERJ-3EKF1003V
R33 R38 R39 = rcl:R-EU_: RESISTOR, European symbol; MPN: CRCW060310R0FKEAHP
R34 = rcl:R-EU_: RESISTOR, European symbol; MPN: ERJ-3EKF1001V
R40 R41 = resistor:R-EU_: RESISTOR, European symbol; MPN: ERJ-3EKF2002V
R42-R44 = resistor:R-EU_: RESISTOR, European symbol; MPN: ERJ-3EKF8202V
R45 = rcl:R-EU_: RESISTOR, European symbol; MPN: ERJ-PA3F2700V
R46 = rcl:R-EU_: RESISTOR, European symbol; MPN: ERJ-PA3F2001V
R48 R49 = rcl:R-EU_: RESISTOR, European symbol; MPN: CR0603-FX-1002HLF
R50 = resistor:R-EU_: RESISTOR, European symbol; MPN: ERJ-2GEJ434X
R51 = resistor:R-EU_: RESISTOR, European symbol; MPN: ERJ-2RKF8202X
R53 = resistor:R-EU_: RESISTOR, European symbol; MPN: ERJ-2GE0R00X
RV1 RV6 = rezzonics:POT; MPN: 3310Y-001-103L
RV2 = rcl:R-TRIMM: Trimm resistor; MPN: 3314G-1-105E
RV3 RV10 = rcl:R-TRIMM: Trimm resistor; MPN: 3314G-2-103E
RV4 RV5 = rezzonics:POT; MPN: 3310Y-001-204L
RV7 = rezzonics:DPOT1: 3310H 9mm dual gang pot Datasheet <http://www.bourns.com/docs/Product-Datasheets/3310.pdf>; MPN: 3310H-001-104L
RV8 RV9 = rezzonics:POT; MPN: 3310Y-001-504L
SW1 SW2 = rezzonics:SPDT: SPDT SLIDING SWITCH 4mm spacing through hole, vertical SPDT slide switch APEM MHS122K <http://www.apem.com/files/apem/brochures/MHS_MINI_SLIDE.pdf>; MPN: MHS122K
SW3 SW4 = rezzonics:SPDT1: SPDT1; MPN: GH36P010001
TP1-TP22 = testpad:TP: Test pad; MPN: *
U1 = rezzonics:NUTUBE_6P1: NUTUBE 6P1 Twin Triode Datasheet <http://nutube.us/downloads/Nutube_Datasheet_31.pdf>; MPN: *
U2 = Texas Instruments_By_element14_Batch_1:TPA3112D1PWP: CLASS-D AUDIO POWER AMPLIFIER; MPN: TPA3112D1PWP; OC_FARNELL: 1781260; OC_NEWARK: 32R7817; PACKAGE: HTSSOP-28; SUPPLIER: Texas Instruments
U3 = Texas Instruments_By_element14_Batch_1:TL972ID: OPERATIONAL AMPLIFIERS; MPN: LME49723MA/NOPB; OC_FARNELL: 1755226; OC_NEWARK: 52M6085; PACKAGE: SOIC-8; SUPPLIER: TI
U4 = Texas Instruments_By_element14_Batch_1:TPA6111A2D: AUDIO POWER AMPLIFIER; MPN: TPA6111A2D; OC_FARNELL: 8456593; OC_NEWARK: 38K8607; PACKAGE: SOIC-8; SUPPLIER: TI
U5 = rezzonics:TPS62175DQCR; DATASHEETURL: httpwww.ti.comproducttps62175; FREQUENCY: 1000000.0; IMAX: 0.5; MANUFACTURER_NAME: Texas Instruments; MANUFACTURER_PART_NUMBER: TPS62175DQCR; MKTG_PACKAGE: TPS62175; MPN: TPS62175DQCR; NSID: TPS62175DQCR; PACKAGE: TPS62175; VENDOR: Texas Instruments
V1 = tubes:12AU7-P; MPN: *
VR1 VR2 = rcl:R-TRIMM: Trimm resistor; MPN: 3314G-1-504E

## Net classes
0 default: width 0.25 mm, drill 0.5 mm, clearance 0.254 mm
1 PWR: width 0.4 mm, drill 0.5 mm, clearance 0.254 mm

## Board
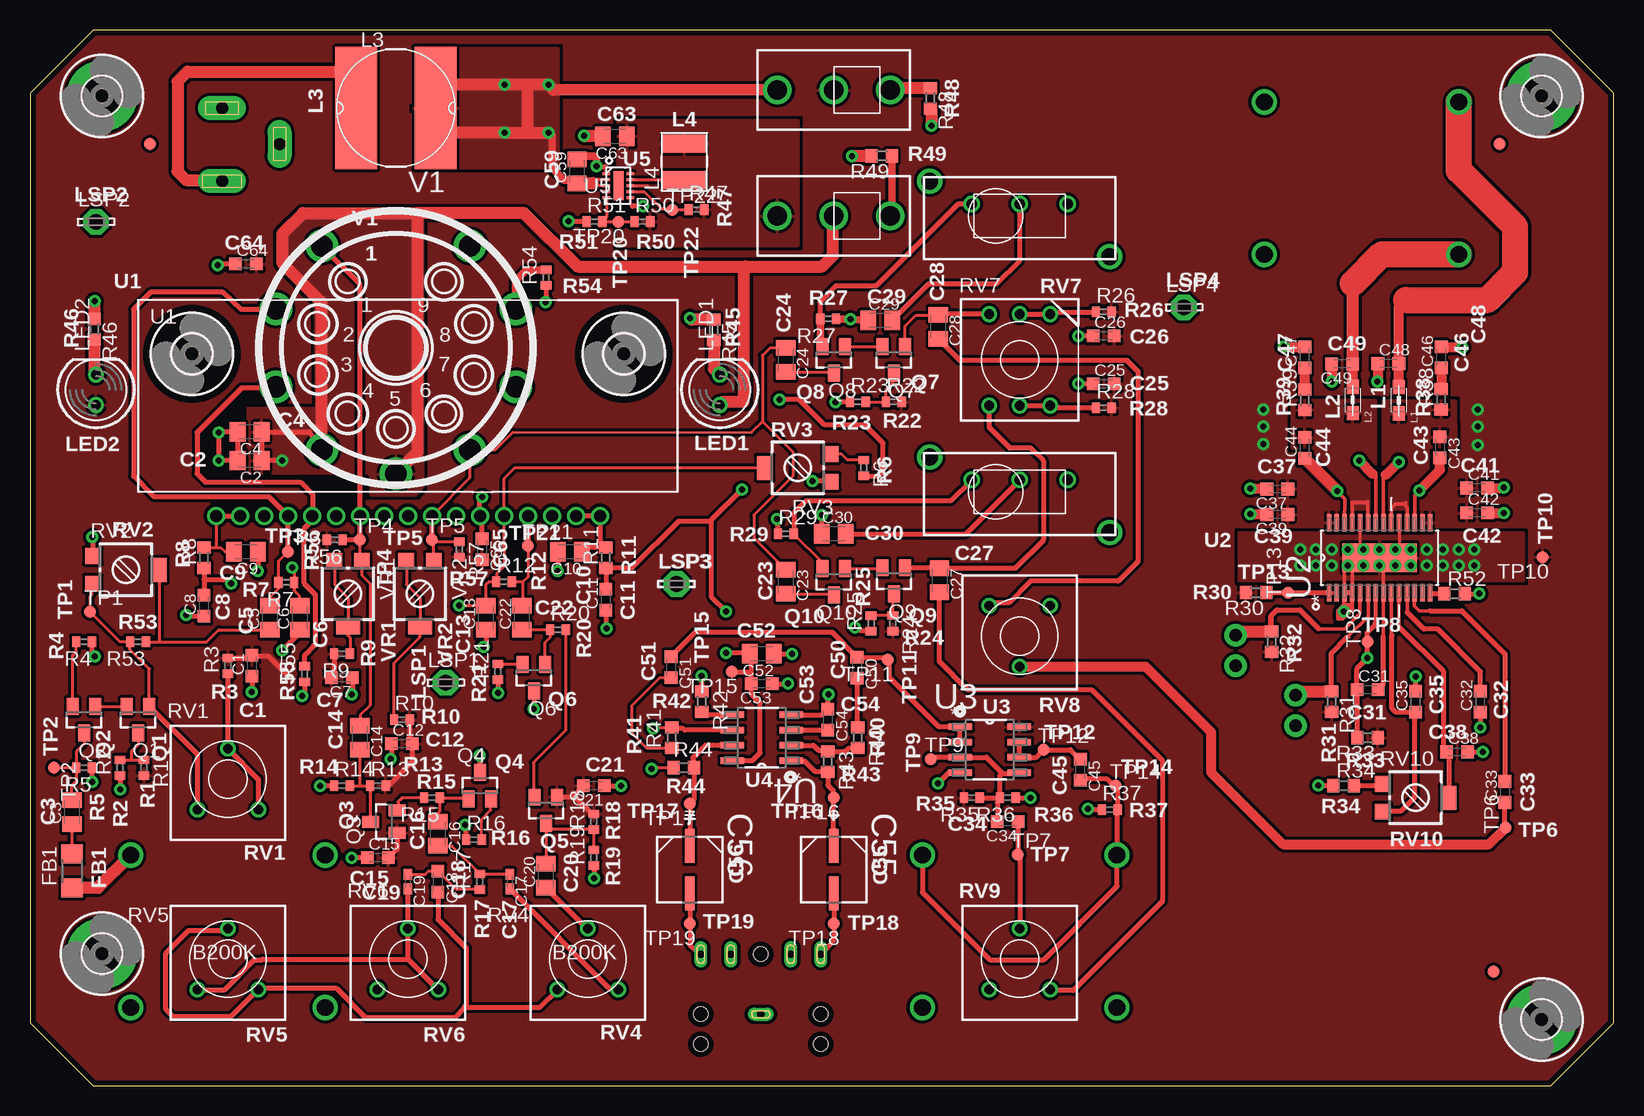
[diagram p3: board, top side]
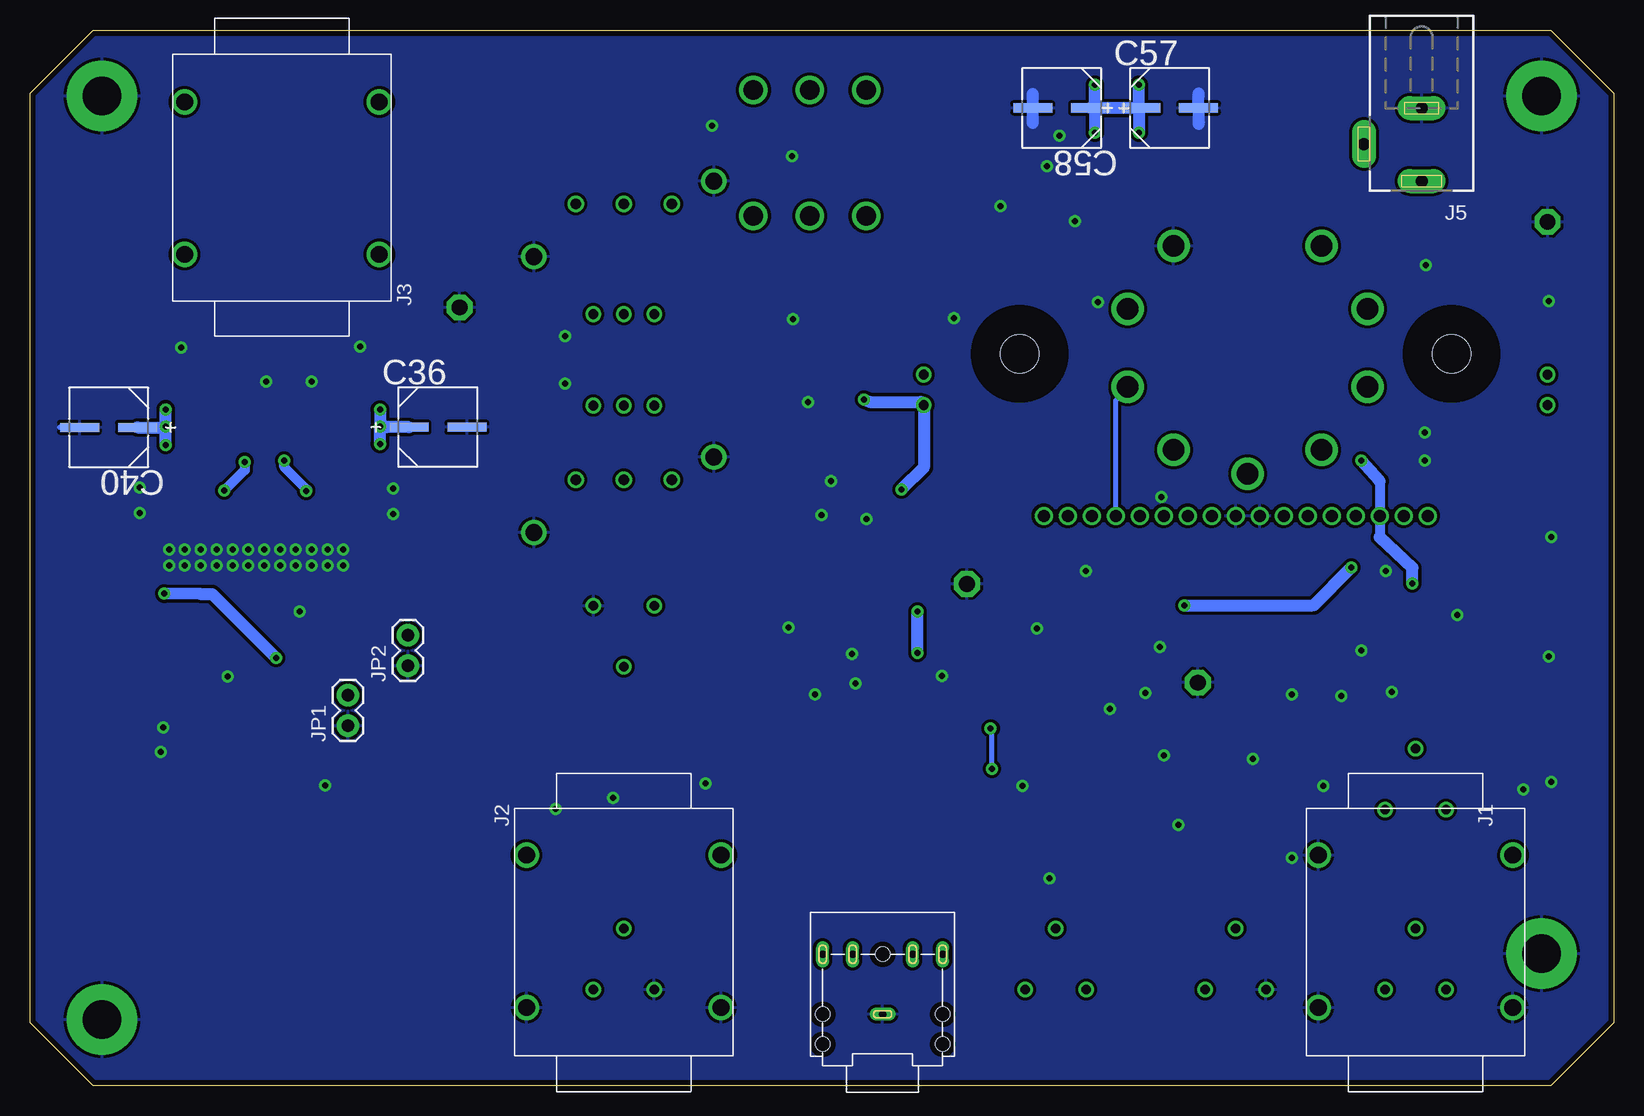
[diagram p4: board, bottom side, seen from below]

Size 132 x 88 mm. Coordinates in mm from the lower left corner, seen from the top.
Outline: 132,5.25 132,82.75 126.75,88 5.25,88 0,82.75 0,5.25 5.25,0 126.75,0 132,5.25
Copper layers (1*16): Top 0.018mm / dielectric 1.5mm / Bottom 0.018mm
Design rules "Rezzonics 2-layers *": minimum track width 0.25mm, minimum drill 0.25mm, track to track 0.25mm, track to pad 0.25mm, pad to pad 0.25mm, via to via 0.25mm, smd to smd 8mil, copper to edge 0.45mm, drill to drill 0.45mm, minimum pad ring 0.25mm, minimum via ring 0.25mm, stop-mask expansion 4mil, vias tented up to drill 0mil, thermal gap 0.25mm

### Footprints (pad centres in the part's own frame; a part is rotated, then mirrored left to right if it is on the bottom)
C0603K = smd 1.05 x 1.08: 1 -0.875,0; 2 0.875,0
C0805K = smd 1.3 x 1.6: 1 -1,0; 2 1,0
C0402K = smd 0.925 x 0.74: 1 -0.6,0; 2 0.6,0
CAPAE660X800N = smd 3.251 x 0.762: 1 -2.413,0; 2 2.413,0
CAPAE530X610N = smd 2.87 x 0.762: 1 -1.981,0; 2 1.981,0
R1206 = smd 1.6 x 1.803: 1 -1.422,0; 2 1.422,0
3,2 = hole 3.2: 0,0
3,2-PAD = drill 3.2 pad 5.842: B3,2 0,0
NEUTRIK-NMJ4HCD2 = drill 1.4: S -8.115,-4; SN 8.115,-4; T -8.115,-16.7; TN 8.115,-16.7
35RAPC4BHN2 = drill 0.6 long: 1 0,0; 2 5,-5; 3 5,5; 10 5,-2.5; 11 5,2.5 | hole 1.2: 5,0; -2.5,-5; 0,-5; 0,5; -2.5,5
DCJ0202 = drill 1 pad 2 long: 1 0,3.1; 2 4.8,0; 3 0,-3
1X02 = drill 1.016 pad 1.88: 1 0,0; 2 2.54,0
FIDUCIAL-1X2.5 = smd 1 x 1: 1 0,0
0805 = smd 1.2 x 1: 1 -1.1,0; 2 1.1,0
SRN1060 = smd 3.5 x 10.2: 1 -3.3,0; 2 3.3,0
SRN4018 = smd 1.5 x 3.6: 1 -1.525,0; 2 1.525,0
LED5MM = drill 0.8 pad 1.3: A -1.27,0; K 1.27,0
LSP13 = drill 1.321 pad 2.159 octagon: MP 0,0
SOT23 = smd 1 x 1.4: 1 -0.95,-1.1; 2 0,1.1; 3 0.95,-1.1
R0402 = smd 0.7 x 0.9: 1 -0.65,0; 2 0.65,0
R0603 = smd 1 x 1.1: 1 -0.85,0; 2 0.85,0
3310Y = drill 0.8 pad 1.3: P$1 -2.54,0; P$2 0,5.08; P$3 2.54,0
RTRIM3314G = smd 1.3 x 1.3: 1 1.15,-2.75; 3 -1.15,-2.75 | smd 2 x 1.3: 2 0,2.75
3310H = drill 0.8: P$1 -2.54,3.81; P$2 0,3.81; P$3 2.54,3.81; P$4 -2.54,-3.81; P$5 0,-3.81; P$6 2.54,-3.81
MHS122K = drill 0.9: 1 0,0; 2 0,-4; 3 0,-8 | drill 1.4: 4 1.9,3.5; 5 -4.4,-11.5
GH39P0 = drill 1.6: 1 0,4.7; 2 0,0; 3 0,-4.7
TP10R = smd 1 x 1: TP 0,0
NUTUBE_6P1_1 = drill 1: 1 -16,-4; 2 -14,-4; 3 -12,-4; 4 -10,-4; 5 -8,-4; 6 -6,-4; 7 -4,-4; 8 -2,-4; 9 0,-4; 10 2,-4; 11 4,-4; 12 6,-4; 13 8,-4; 14 10,-4; 15 12,-4; 16 14,-4; 17 16,-4
SOP65P640X120-29N = smd 1.473 x 0.356: 1 -2.921,4.216; 2 -2.921,3.581; 3 -2.921,2.921; 4 -2.921,2.286; 5 -2.921,1.626; 6 -2.921,0.965; 7 -2.921,0.33; 8 -2.921,-0.33; 9 -2.921,-0.965; 10 -2.921,-1.626; 11 -2.921,-2.286; 12 -2.921,-2.921; 13 -2.921,-3.581; 14 -2.921,-4.216; 15 2.921,-4.216; 16 2.921,-3.581; 17 2.921,-2.921; 18 2.921,-2.286; 19 2.921,-1.626; 20 2.921,-0.965; 21 2.921,-0.33; 22 2.921,0.33; 23 2.921,0.965; 24 2.921,1.626; 25 2.921,2.286; 26 2.921,2.921; 27 2.921,3.581; 28 2.921,4.216 | smd 2.388 x 6.172: 29 0,0
SOIC127P600X175-8N = smd 1.981 x 0.559: 1 -2.464,1.905; 2 -2.464,0.635; 3 -2.464,-0.635; 4 -2.464,-1.905; 5 2.464,-1.905; 6 2.464,-0.635; 7 2.464,0.635; 8 2.464,1.905
R-PWSON-N10 = smd 0.61 x 0.254: 1 -1.003,1; 2 -1.003,0.5; 3 -1.003,0; 4 -1.003,-0.5; 5 -1.003,-1; 6 1.003,-1; 7 1.003,-0.5; 8 1.003,0; 9 1.003,0.5; 10 1.003,1 | smd 0.838 x 2.388: 11 0,0
VT9 = drill 1.8: 1 6.172,-8.495; 2 9.986,-3.245; 3 9.986,3.245; 4 6.172,8.495; 5 0,10.5; 6 -6.172,8.495; 7 -9.986,3.245; 8 -9.986,-3.245; 9 -6.172,-8.495

### Placement (x,y rotation side)
C1  18.5,35 90 top
C2  18.31,52.1 180 top
C3  3.5,22.79 90 top
C4  18.31,54.5 180 top
C5  20,39 90 top
C6  22.5,39 90 top
C7  26,34 180 top
C8  14.5,40 90 top
C9  18,44.5 180 top
C10  45,44.5 180 top
C11  48,40.5 90 top
C12  31,28.5 0 top
C13  38,39 90 top
C14  27.5,29 270 top
C15  29,19 0 top
C16  34,21 270 top
C17  40,17 270 top
C18  34,17 270 top
C19  31.5,17 270 top
C20  43,17.5 90 top
C21  47,25 180 top
C22  41,39 90 top
C23  63,42 270 top
C24  63,60.5 270 top
C25  89.5,58.5 0 top
C26  89.5,62.5 0 top
C27  75.82,42.13 270 top
C28  75.71,63.26 270 top
C29  70.86,63.79 0 top
C30  67,46 0 top
C31  111.5,33 0 top
C32  120.9,32 90 top
C33  122.95,24.48 90 top
C34  81.5,22 180 top
C35  115.5,32 90 top
C36  97.99,54.89 0 bottom
C37  103.98,49.73 180 top
C38  118.97,27.81 0 top
C39  103.98,47.62 180 top
C40  125.45,54.87 180 bottom
C41  120.64,49.83 0 top
C42  120.64,47.75 0 top
C43  117.53,53.21 270 top
C44  106.26,53.16 90 top
C45  87.55,26.32 270 top
C46  117.63,60.7 90 top
C47  106.26,60.7 90 top
C48  113.23,60.2 0 top
C49  109.39,60.16 180 top
C50  68.95,34.83 270 top
C51  53.45,34.89 270 top
C52  61,36 180 top
C53  61,33.5 180 top
C54  66.5,30.5 270 top
C55  67,18 270 top
C56  55,18 270 top
C57  37,81.5 0 bottom
C58  46,81.5 180 bottom
C59  45.6,76.22 90 top
C63  48.76,79.13 180 top
C64  18,68.5 0 top
C65  37.69,44.7 270 top
FB1  3.5,17.89 90 top
H1  13.5,61 0 top
H2  126,82.5 0 top
H3  49.5,61 0 top
H4  126,5.5 0 top
H6  6,82.5 0 top
H7  6,11 0 top
J1  16.5,2.5 180 bottom
J2  82.5,2.5 180 bottom
J3  111,86 0 bottom
J4  60.92,5.94 90 bottom
J5  16,78.5 180 bottom
JP1  105.5,30 90 bottom
JP2  100.5,35 90 bottom
JP3  122.5,78.5 0 top
JP4  10,78.5 0 top
JP5  122,9.5 0 top
L1  114.1,57.13 90 top
L2  110.26,57.16 90 top
L3  30.5,81.5 0 top
L4  54.55,77.02 90 top
LED1  57.5,58 90 top
LED2  5.5,58 90 top
LSP1  34.65,33.59 0 top
LSP2  5.5,72 0 top
LSP3  53.89,41.81 0 top
LSP4  96.2,64.87 0 top
Q1  9,30.5 180 top
Q2  4.5,30.5 180 top
Q3  29.5,22 90 top
Q4  37.5,25 0 top
Q5  43.01,22.95 180 top
Q6  42,34 180 top
Q7  72,60.5 180 top
Q8  67,60.5 180 top
Q9  72.01,42.07 180 top
Q10  67,42 180 top
R1  9.5,26.5 270 top
R2  7.5,26.5 90 top
R3  16.5,35 90 top
R4  4.5,37 180 top
R5  4.5,26.5 180 top
R6  69.5,51.5 270 top
R7  21.37,41.95 180 top
R8  14.5,44 90 top
R9  26,36 180 top
R10  31,30.5 0 top
R11  48,44 90 top
R12  39.5,42 0 top
R13  29,25 0 top
R14  26,25 0 top
R15  33.5,24 180 top
R16  37,20.5 0 top
R17  37.5,17 90 top
R18  47,22 90 top
R19  47,19 90 top
R20  44,38 0 top
R21  39,34.5 90 top
R22  72,57 0 top
R23  69,57 0 top
R24  71.93,38.54 270 top
R25  70.11,38.52 90 top
R26  89.5,64.5 0 top
R27  66.54,63.92 180 top
R28  89.5,56.5 0 top
R29  63,46 0 top
R30  102.2,41.1 180 top
R31  108.5,32 270 top
R32  103.5,37 270 top
R33  111.5,29 180 top
R34  109.5,25 0 top
R35  78.5,24 180 top
R36  81.5,24 180 top
R37  90,23 0 top
R38  117.63,57.21 90 top
R39  106.26,57.16 90 top
R40  69,29 270 top
R41  53.5,29 90 top
R42  56,32 270 top
R43  66.5,27 270 top
R44  54.5,26.5 0 top
R45  57,63 270 top
R46  5.36,63.05 270 top
R47  55.55,73.02 0 top
R48  75.05,82.3 270 top
R49  71,77.5 180 top
R50  51.05,72.02 0 top
R51  47.05,72.02 0 top
R52  118.76,41 0 top
R53  9,37 180 top
R54  43.02,67.36 90 top
R55  22.9,34.3 90 top
R56  25.41,45.49 180 top
R57  35.79,44.7 270 top
RV1  16.5,23 0 top
RV2  8,43 270 top
RV3  64,51.5 90 top
RV4  46.5,8 0 top
RV5  16.5,8 0 top
RV6  31.5,8 0 top
RV7  82.5,60.5 0 top
RV8  82.5,40 180 top
RV9  82.5,8 0 top
RV10  115.5,24 270 top
SW1  78.5,50.5 90 top
SW2  78.5,73.5 90 top
SW3  67,72.5 270 top
SW4  67,83 270 top
TP1  5,39.5 0 top
TP2  2,26.5 270 top
TP3  21.5,44.5 0 top
TP4  27.5,45.5 0 top
TP5  33.5,45.5 0 top
TP6  123,21.5 90 top
TP7  82.34,19.24 0 top
TP8  111.5,37 90 top
TP9  75.07,27.22 0 top
TP10  126.09,44.06 180 top
TP11  71.5,35.5 180 top
TP12  84.5,28 0 top
TP13  104.86,41.1 90 top
TP14  90.5,25 0 top
TP15  58.5,34.5 180 top
TP16  67,24 180 top
TP17  55,23.5 180 top
TP18  67,13.5 180 top
TP19  55,13.5 180 top
TP20  49.05,72.02 180 top
TP21  41.5,45 0 top
TP22  53.55,73.02 0 top
U1  31.5,51.5 0 top
U2  112.5,44 90 top
U3  80,28 0 top
U4  61,29 180 top
U5  49.05,75.02 0 top
V1  30.5,61.5 180 top
VR1  26.5,41 180 top
VR2  32.5,41 180 top

### Tracks (layer width: path | path; a pad name or v marks a point on that pad's centre or on a via)
+5V  (via drill 0.5 pad 1)
  Top 0.406: C11.2 R11.1 50.16,43.15 54.05,47.04 56.69,47.04 56.83,47.17 | U4.8 60.22,27.09 60.86,27.74 60.86,31.9 60.15,32.61 60.15,33.48 C53.2 60.12,34.54 | 60.12,34.54 60.12,35.88 C52.2 59.93,36.07 v58.01,36.07 | TP15.TP 60.08,34.5 60.12,34.54 | R8.1 14.5,42.21 | 14.5,42.21 C8.2 | V1.4 23.29,54.5 C4.1 C2.1 19.33,52.12 v21.03,52.12 | 14.5,42.21 16.42,42.21 v16.76,41.86 | R6.2 69.55,50.8 70.71,50.8 71.12,51.21 71.12,53.54 69.6,55.07 66.24,55.07 64.11,57.2 v62.48,57.2 | v59.33,49.68 56.83,47.17 | v58.01,39.51 56.83,40.7 56.83,47.17
  Top 1.016: 32.31,72.75 22.76,72.75 21.03,71.02 21.03,68.58 24.28,65.33 24.28,53.05 V1.4 | V1.5 32.31,52.81 32.31,72.75 | LED1.A 57.77,57 59.5,57 59.5,68.14 59.64,68.28 | 59.64,68.28 45.63,68.28 41.16,72.75 32.31,72.75 | 59.64,68.28 66.04,68.28 66.95,69.19 66.95,72.45 SW3.2
  Bottom 0.813: 19.5,50.39 19.5,45.7
  Bottom 1.016: v62.48,57.2 62,57 57.77,57 LED1.A 57.5,51.52 v59.33,49.68 | v58.01,36.07 v58.01,39.51 | v16.76,41.86 16.76,43.16 19.5,45.7 | 19.5,50.39 v21.03,52.12
  pour Top: 18.19,56.49 23.88,56.49 23.77,65.53 21.13,68.17 21.13,71.22 22.56,72.64 32.72,72.64 32.72,49.83 32.16,49.17 28.45,49.17 28.45,50.75 28.19,51 18.19,51
+5V_L
  Top 0.25: U5.8 51.48,75.02 51.5,75
  pour Top: 49,80.5 64,80.5 64,70 49,70
+24V  (via drill 0.5 pad 1)
  Top 0.406: Q5.1 45.17,24.05 45.31,24.18 | 45.31,24.18 C21.2 | R18.2 46.84,22.65 45.31,24.18 | R10.2 31.65,28.73 C12.2 31.9,28.47 31.9,27.03 29.88,25 R13.2 | R9.2 25.35,34.23 C7.2 | 21.68,34 19.91,35.76 18.61,35.76 C1.2 18.27,35.65 R3.2 | Q3.1 30.6,19.73 C15.2
  Bottom 0.813: 120.7,56.39 120.69,56.4 | 120.7,55.07 120.69,55.08 120.69,54.88 | 102.83,54.89 102.82,54.88 102.83,54.87
  Bottom 1.016: C40.1 120.95,54.87 v120.7,54.92 120.7,56.39 | C36.1 102.29,54.89 v102.83,54.92 | v120.7,53.4 120.7,55.07 | v102.83,56.34 102.83,54.89 | v102.83,53.5 102.83,54.87
  other vias: 120.7,56.34
  pour Top (rank 2): 0,88 132,88 132,0 0,0 0,87.5
+24V_L  (via drill 0.5 pad 1)
  Top 0.25: U5.3 47.13,75.02 46.93,75.22 | U5.2 47.22,75.52 46.94,75.23
  Top 0.61: C59.1 45.32,75.5 44.5,75.5 43.5,76.5 43.5,79.17 v43.21,79.46
  Top 1.016: C59.1 46.93,75.22 46.94,75.23 | 41.49,79.46 v39.56,79.46 34.04,79.46 34,79.5 | 41.49,79.46 v43.21,79.46 | 41.49,79.46 41.49,83.35 41.59,83.45 | SW4.3 43.63,83 v43.21,83.42 v39.56,83.42 34.58,83.42 34,84 34,81.7 L3.2
  Bottom 1.016: C57.1 43.21,81.5 | 43.21,81.5 C58.1 | C57.1 39.56,81.36 v39.56,79.46 | C57.1 39.56,81.64 v39.56,83.42 | 43.21,81.5 | 43.21,81.5 v43.21,79.46 | 43.21,81.5 v43.21,83.42
  pour Top: 32,86.5 44,86.5 44,76.5 32,76.5
+24VIN
  Top 1.016: J5.1 15.91,75.49 13.01,75.49 12.29,76.2 12.29,83.72 13.11,84.53 26.97,84.53 27.5,84 27.5,81.8 L3.1
+UB
  Top 0.305: U2.10 114.11,41.07 114.11,38.23 114.16,38.18
  Top 0.406: 114.16,38.18 117.85,34.5 117.85,28.06 C38.1 118.25,27.66 RV10.2
AMP_IN
  Top 0.406: TP6.TP 122.95,21.55 C33.1
  Top 0.813: RV8.P$2 92.99,34.92 98.45,29.46 98.45,26.11 104.44,20.12 121.62,20.12 TP6.TP
AN1
  Top 0.25: TP4.TP 27.5,43.9 VR1.3 27.65,42.56 28.35,41.86 28.35,31.7 27.53,30.89 27.53,30.03 C14.1
  Top 0.406: R56.1 26.07,45.5 TP4.TP U1.7 27.5,66.82 V1.1
AN2
  Top 0.25: VR2.3 33.65,45.35 | 33.65,45.35 TP5.TP | C24.1 61.7,61.5 61.06,60.86 61.06,55.37 | 61.06,55.37 63.6,52.83 63.6,50.8 60.35,47.55 60.35,45.65 C23.1 | 61.06,55.37 60.17,54.48 40.23,54.46 38.81,53.01 V1.6 | 33.65,45.35 R57.1
  Top 0.254: U1.10 36.67,50.67 V1.6
  Top 0.406: TP5.TP U1.10
BAST
  Top 0.406: 19.04,7.76 RV5.P$3 | 36.27,6.5 36.17,6.5 36.37,6.71 36.37,11.48 34,13.85 C18.2 | 36.27,6.5 42.46,6.5 RV4.P$1 | RV5.P$2 16.32,12.9 13.21,12.9 11.28,10.97 11.28,6.4 11.89,5.79 16.76,5.79 18.97,8 RV5.P$3 | RV5.P$3 19.11,8.13 25.5,8.13 27.94,5.69 35.46,5.69 36.27,6.5
BIAS  (via drill 0.5 pad 1)
  Top 0.25: C6.2 22.45,40.05 22.45,40.84 22.02,41.28 R7.1 22.11,41.86 | R12.1 38.24,42 38,41.76 C13.2 35.79,40 v35.76,40.03 | RV3.2 61.24,51.51 40.44,51.51 39.52,50.6 39.52,44.7 | 22.05,42.06 22.05,42.98 v21.84,43.18
  Top 0.254: 39.52,44.7 39.52,43.28 38.91,42.67 38.91,42.06 R12.1
  Top 0.406: 22.11,41.86 22.11,42.01 22.05,42.06
  Bottom 0.25: 25.09,40.03 24.99,40.03
  Bottom 1.016: v35.76,40.03 25.09,40.03 | 24.99,40.03 v21.84,43.18
EQIN
  Top 0.25: C17.1 37.55,17.6 R17.2 35.15,20 C16.2
EQOUT
  Top 0.406: RV4.P$2 46.42,13.08 C20.1
FXIN
  Top 0.25: R5.2 3.85,25.39 3.45,24.99 3.45,23.83 C3.2 | Q2.2 4.5,28.48 3.86,27.84 3.86,26.51 R5.2 | R5.2 TP2.TP
G1
  Top 0.25: C5.2 20.02,40.02 20.02,40.74 20.72,41.45 R7.2 20.72,43.72 TP3.TP
  Top 0.406: TP3.TP U1.4 19.93,49.07 10.36,49.07 8.64,50.8 8.64,64.72 10.06,66.14 16.05,66.14 17.6,64.69 20.46,64.69 V1.2
G2
  Top 0.254: TP21.TP 41.5,42.41 41.05,41.96 | 41.05,41.96 40.19,41.96 R12.2 | 41.05,41.96 41.05,40.05 C22.2
  Top 0.406: U1.14 TP21.TP
  Bottom 0.406: U1.14 41.5,57.11 V1.7
G2TOP
  Top 0.406: V1.3 20.43,58.17 17.63,58.17 13.92,54.46 13.92,51 14.63,50.29 22.55,50.29 23.57,49.28 23.57,47.14 22.86,46.43 22.86,41.86 23.77,40.95 23.77,36.77 23.55,36.55 23,36 22.9,35.9 R55.2
G3TOP
  Top 0.406: RV7.P$2 RV7.P$3 85.23,64.5 R26.1
G4TOP
  Top 0.406: RV7.P$5 RV7.P$6 85.23,56.5 R28.1
GND  (via drill 0.5 pad 0.3, 0.5 pad 0.5, 0.5 pad 1)
  Top 0.25: 110.15,40.11 109.64,40.11 109.54,40.22 | v109.54,39.51 109.54,39.4 | U2.19 114.13,45.01 v113.8,44.69 | U2.24 110.87,45.08 v111.16,44.69 | 112.83,43.02 v112.48,43.37 | 110.21,42.99 v109.84,43.37 109.58,43 | 50.2,73.3 50.05,73.45 U5.6 | U5.1 48,76.06 48,76.6
  Top 0.305: 112.79,37.47 112.83,37.52 U2.8 112.83,43.02 | 109.54,40.11 109.03,39.61 109.03,38.9 109.44,38.9 110.21,39.67 U2.4 110.21,42.99 | 109.54,40.11 109.54,40.22 109.54,40.72 | 109.54,40.11 v109.54,39.51 | U2.3 109.58,43
  Top 0.406: 5.36,65.38 v5.38,65.41 | C64.1 15.77,68.5 v15.65,68.38 | R54.1 43.02,65.37 v42.98,65.33 | R51.1 44.97,72.02 v44.9,72.08 | C15.1 v26.82,19 | R14.1 v24.18,24.99 | R23.1 v67.16,57 | RV3.3 66.71,50.39 v65.23,50.39 | R25.1 70.08,37.9 69.19,37.9 68.89,38.2 v68.78,38.2 | U4.4 66.03,30.91 C54.1 66.5,32.57 v66.55,32.61 | 122.78,49.83 v122.85,49.87 | 122.73,47.75 v122.85,47.73 | 119.43,61.57 v119.39,61.53 | v108.51,58.69 v108.52,58.69 | C47.2 106.3,61.6 | 101.73,47.62 v101.71,47.63 | 101.75,49.73 v101.71,49.77 | R36.1 83.38,24 v83.41,23.97 | R37.1 88.24,23 v88.19,23.05 | U3.4 76.6,26.09 v75.69,25.19 | R42.1 56,34.12 v55.98,34.14 | C53.1 63.17,33.5 v63.2,33.53 | C52.1 63.67,36 v63.5,35.97 | C11.1 48,38.16 v48.06,38.1 | C10.2 v44,42.88 v43.99,42.88 | C13.1 38,36.78 v37.8,36.58 | R21.1 39,32.83 v39.01,32.72 | Q6.2 42,31.43 v41.96,31.39 | R16.1 36.35,21.56 v36.27,21.74 | R19.1 47,17.31 v47.04,17.27 | C21.1 v49.27,25 v49.28,24.99 | C30.1 66,47.51 v66.04,47.55 | R29.1 62.35,47.17 v62.28,47.24 | RV2.3 5.25,45.65 v5.18,45.72 | R4.1 5.15,36 v5.38,35.76 | C8.1 13.1,39.12 v13.01,39.22 | C9.1 19,42.57 v19,42.88 | v15.75,54.46 15.79,54.5 C4.2 C2.2 15.77,52.1 | 15.77,52.1 v15.75,52.12 | 15.77,52.1 15.77,54.34 15.75,54.36 | 22.9,33.61 R55.1 22.9,32.69 v22.68,32.47 | C1.1 18.5,33.03 v18.49,32.82 | C6.1 22.5,37.74 v21.03,36.27 | C7.1 26.88,32.67 v26.82,32.61 | C12.1 30.12,27.28 v30.07,27.23 | Q4.2 37.5,27.63 v37.49,27.53 | U2.4 U2.3 | 112.79,37.47 112.79,33.41 C31.2 | C38.2 121.01,27.81 v121.12,27.82 | C32.1 120.9,30.04 v120.92,29.85 | v109.54,39.51 110.15,40.11 | 109.54,39.4 109.13,39 | R34.1 107.33,25 v107.4,25.03 | C35.2 115.5,34.09 v115.53,34.12 | C25.1 87.4,58.5 v87.38,58.52
  Top 0.406: C26.1 87.39,62.5 v87.38,62.48 | R2.1 7.5,24.91 v7.52,24.69 | R5.1 5.15,25.43 v5.18,25.3 | v51.1,73.3 50.2,73.3 | v47.24,76.65 47.29,76.6 48,76.6 | C65.1 37.69,47.24 37.49,47.45 37.49,48.87 v37.69,49.07
  Top 0.61: R27.1 67.21,63.91 v68.38,63.91 68.29,63.89 C29.1 | C59.2 45.88,77.5 47,77.5 47.24,77.26 v47.24,76.65
  Top 0.813: C41.2 122.78,49.83 | C42.2 122.73,47.75 | C46.2 119.43,61.57 | C49.2 v108.51,58.69 | C39.2 101.73,47.62 | C37.2 101.75,49.73 | 46.27,79.13 v46.2,79.2 | v104.5,61.6 104.6,61.55 106.23,61.55 C47.2 | C48.1 112.35,58.75 v112.3,58.7
  Top 1: R48.2 75.13,81.38 v75.13,80
  Top 1.016: C63.2 46.27,79.13 | R49.2 v68.5,77.5 | R45.1 55.15,63.85 v55,64 | 5.36,65.38 R46.1
  Bottom 0.406: C40.2 129.54,54.88
  Bottom 1.016: 34.58,80.17 34.59,80.38 C57.2 34.59,82.5 34.58,82.71 | C58.2 48.41,82.56 48.42,82.67 48.42,80.23
  other vias: 113.8,43.37 115.12,43.37 115.12,44.69 112.48,44.69 109.84,44.69 111.16,43.37 116.45,43.37 116.45,44.69 117.77,44.69 117.77,43.37 119.09,43.37 119.09,44.69 108.52,43.37 108.52,44.69 107.2,43.37 107.2,44.69 120.41,43.37 120.41,44.69 105.88,43.37 105.88,44.69
  pour Bottom: 0,88 132,88 132,0 0,0
  pour Top: 124.47,42.04 100.8,42.04 100.8,46.11 124.47,46.11
GTOP
  Top 0.25: R53.1 10.77,37 | 10.77,37 14.75,37 15.75,38 C5.1 | RV2.2 10.75,37.02 10.77,37
GVDD
  Top 0.305: U2.9 113.47,37.61 113.53,37.55
  Top 0.406: 113.53,37.55 113.53,31.45 113.86,31.12 C35.1 115.43,31.06 115.43,24.02 114.31,22.9 112.8,22.9 RV10.1
HEAD_IN
  Top 0.406: C51.1 55.47,37.8 66.86,37.8 C50.1 71.3,35.7 TP11.TP 71.63,35.37 71.63,34.04 75.76,29.91 U3.1 U3.2
K1
  Top 0.25: R8.2 15.54,44.85 | 15.54,44.85 15.91,44.85 16.26,44.5 C9.2 | U1.1 15.5,44.9 15.54,44.85
  Top 0.406: U1.1 U1.2
K2
  Top 0.406: U1.16 U1.17 47.5,45.35 R11.2 46.35,44.85 C10.1
LINE_OUT
  Top 0.406: U3.7 U3.6 83.86,27.36 TP12.TP 86.74,28 C45.1
MIDT
  Top 0.406: C19.2 RV6.P$2 31.5,10.54 | RV5.P$1 16.23,8 18.69,10.46 19.3,10.46 19.38,10.54 31.5,10.54 | RV6.P$3 31.5,10.54
N$1
  Top 1.016: J1.T 5.65,16.47 FB1.1
N$2
  Top 0.25: FB1.2 C3.1
N$3
  Top 0.406: U4.2 65.31,28.36 65.73,27.94 66.41,27.94 R43.1 67.98,27.85 68.28,28.14 R40.2
N$4
  Top 0.25: R47.1 TP22.TP 53.47,73.1 52.63,73.1 51.21,74.52 U5.7
N$5
  Top 0.25: R15.2 31.01,24 30.68,23.67 30.68,23.03 Q3.3
N$6
  Top 1.016: R48.1 71.85,83.15 SW4.1
N$7
  Top 0.61: R49.1 71.85,72.65 SW3.1
N$8
  Top 0.406: R52.1 116.72,41 U2.14
N$10  (via drill 0.5 pad 1)
  Top 0.25: R44.1 51.94,26.5 v51.82,26.42 | v51.92,29.77 52.12,29.87 53.48,29.87 R41.2
  Top 0.406: U4.6 54.59,29.64 54.46,29.77 53.58,29.77 R41.2
  Bottom 0.406: v51.82,26.42 51.82,29.67 v51.92,29.77
N$12
  Top 0.406: U4.1 63.53,27.03 64.62,27.03 65.49,26.15 R43.2 66.5,25.04 66.95,24.59 66.95,24.05 | 66.95,24.05 66.95,20.03 C55.1 | 66.95,24.05 TP16.TP
N$13
  Top 0.406: C34.1 82.34,21.96 TP7.TP 82.5,19.07 RV9.P$2
N$14
  Top 0.406: C56.1 TP17.TP 55.35,23.85 R44.2 55.27,26.58 55.27,27.33 56.3,28.36 U4.7
N$15
  Top 0.406: C50.2 68.95,29.9 R40.1
N$16
  Top 0.25: R41.1 51.41,28.14 50.19,29.36 50.19,31.7 52.51,34.02 C51.2
N$17
  Top 0.406: U4.3 66.49,29.64 C54.2
N$18
  Top 0.406: U4.5 56.24,30.91 R42.2
N$19
  Top 0.406: C55.2 TP18.TP 67,12.16 J4.3
N$20
  Top 0.406: C56.2 TP19.TP 55,11.7 J4.2
N$21
  Top 0.25: R6.1 68.14,52.15 67.67,52.63 66.77,52.63 RV3.1
N$22
  Top 0.61: V1.8 40.49,67.11 41.35,67.97 42.98,67.97 R54.2
N$23
  Top 0.25: U5.9 54.52,75.52 L4.1
N$29
  Top 0.25: C19.1 32.94,17.6 33.22,17.88 C18.1 35.52,16.35 R17.1
N$64
  Top 0.406: 90.5,23.05 R37.2 | C45.2 87.7,25.59 89.71,25.59 90.31,25 TP14.TP 90.65,24.85 R37.2 | R37.2 90.61,22.96 J2.TN 90.61,16.61 84.5,10.5 80,10.5 74.39,16.11 J2.T
N$65
  Top 0.813: C46.1 R38.2
N$66
  Top 0.813: R39.2 C47.1
N$67
  Top 0.406: RV10.3 112.6,25 R34.2
N$68
  Top 0.813: L2.2 C49.1
  Top 1.016: C49.1 110.26,66.86
  Top 2.184: 110.26,66.86 112.7,69.3 J3.T
N$70
  Top 0.813: 119,81.89 J3.S | L1.2 C48.2 114.1,64.9 114.7,65.5
  Top 2.184: 114.7,65.5 121.5,65.5 123.8,67.8 123.8,71.6 119.1,76.3 119.1,81.98 J3.S
N$71
  Top 0.305: U2.20 113.47,48.16 113.8,48.5 114.6,48.5 114.7,48.6 114.7,48.3 114.8,48.2 114.8,46.94 U2.18
  pour Top: 114.8,47.83 112.8,47.9 112.8,57.1 118.8,57.1 118.86,53.17 116.53,53.17 116.5,53.1 116.5,51.3 114.8,49.5
N$72
  Top 0.305: 110.23,56.02 L2.1 110.29,56.09 | U2.25 110.21,48.59 110.2,48.6 111.4,48.6 111.5,48.7 111.53,48.66 U2.23
  pour Top: 112.2,47.9 112.2,57.1 105.2,57.1 105.17,53.16 107,53.16 107.1,53.16 107.1,51.09 110.25,47.84
N$90
  Top 1.016: R45.2 57,59.77 LED1.K
N$102
  Top 1.016: R46.2 5.36,59.41 LED2.K
OUTH
  Top 0.406: C28.2 77.52,60.45 91.44,60.45 92.35,59.54 92.35,43.69 90.73,42.06 83.41,42.06 81.58,40.23 80.19,40.23 RV8.P$3
OUTL
  Top 0.406: C27.2 75.79,41.1 75.79,35.36 78.15,33 88.5,33 94.39,27.11 94.39,15.34 86.97,7.92 85.11,7.92 RV9.P$3 85.04,8.23
OUTL_M
  Top 0.406: R35.1 R36.2 | R36.2 80.85,25.82 81.06,26.03 | 81.06,26.03 82.39,26.03 U3.5 | 79.72,27.36 U3.3 75.21,27.36 TP9.TP | 79.72,27.36 81.06,26.03 | 79.74,27.38 79.72,27.36 | R36.2 80.95,23.9 80.62,23.57 C34.2
PA_BSN  (via drill 0.5 pad 0.3)
  Top 0.305: U2.22 112.2,46.95 112.2,50.7 | 112.2,50.7 112.2,50.8 | 108.98,49.52 109.6,48.9 U2.26 | 112.2,50.7 111.9,51
  Top 0.813: v110.8,52.1 111.9,51 | 108.98,49.52 v108.98,49.57
  Top 1.016: C44.1 v108.98,49.57
  Bottom 0.813: v110.8,52.1 110.8,51.58 108.88,49.66 v108.98,49.57
PA_BSP  (via drill 0.5 pad 0.3)
  Top 0.305: U2.21 112.8,46.95 112.8,50.7 113,50.9 | U2.17 115.42,49.22 v115.8,49.6
  Top 0.813: 113,50.9 v114.1,52 | v115.8,49.6 117.53,51.33 C43.2
  Bottom 0.813: v114.1,52 114.1,51.3 v115.8,49.6
PA_GAIN0
  Top 0.305: U2.5 110.86,41.07 110.86,39.35 109.59,38.08 107.43,38.08 | 103.96,39.66 103.5,39.2 R32.1 103.47,37.88 103.32,37.88
  Top 0.406: 103.32,37.88 103.45,38.01 103.45,39.15 103.96,39.66 105.86,39.66 107.43,38.08
  Top 1.016: JP2.2 100.81,37.85 R32.1
PA_GAIN1
  Top 0.305: U2.6 111.55,41.07 111.55,39.1 109.87,37.42 | R31.1 108.47,32.88
  Top 0.406: 108.47,32.88 108.47,36.02 109.87,37.42
  Top 1.016: JP1.2 105.81,32.85 R31.1
PA_INN
  Top 0.305: U2.11 114.8,41.07 114.8,39.45
  Top 0.406: C32.2 120.9,34.5 117.34,38.06 116.2,38.06 114.8,39.45
PA_INP
  Top 0.305: U2.12 115.41,41.07 115.41,39.99 115.81,39.58 116.7,39.58
  Top 0.406: 116.7,39.58 119.37,39.58 122.95,36 C33.2
PA_SD_N
  Top 0.305: U2.2 U2.1 108.26,41.1 108.19,41.1 105.91,41.1 TP13.TP R30.1
  Top 0.406: R30.1 104.89,41.1 | TP13.TP 108.19,41.1
Q1D
  Top 0.25: Q1.1 9.96,34.75 8.33,36.37 8.33,36.98 R53.2 7.5,37 TP1.TP 5,40.76 5.18,40.95 5.18,41.78 RV2.1
  Top 0.406: RV1.P$1 13.96,27.59 Q1.1
Q1D2
  Top 0.406: RV1.P$3 19.04,25.54 RV1.P$2 R3.1
Q1G
  Top 0.25: R2.2 8.49,27.15 | 8.49,27.15 R1.1 9.45,27.2 | 8.49,27.15 8.49,27.89 9.04,28.45 9.04,29.36 Q1.2
Q1S
  Top 0.25: Q2.3 3.55,35.86 3.86,36.17 3.86,36.99 R4.2
Q1S1
  Top 0.25: R16.2 37.65,22.21 38.41,22.96 38.41,23.86 Q4.3
Q1S2
  Top 0.25: R21.2 41,35.15 Q6.3
Q2D
  Top 0.25: Q2.1 Q1.3
Q3G
  Top 0.25: R14.2 27.53,25 | 27.53,25 R13.1 28.35,22.05 Q3.2 | 27.53,25 27.53,27.97 C14.2
Q3SC
  Top 0.406: C29.2 74.92,66.85 80.57,66.85 82.5,68.78 SW2.2
Q4D
  Top 0.25: C16.1 33.93,22.07 33.93,22.66 34.15,22.87 R15.1 36.45,24 Q4.1
Q5G
  Top 0.25: C20.2 Q5.2 43.5,21.35 R18.1 R19.2
Q5S
  Top 0.25: R20.2 44.65,29.61 41.96,26.92 41.96,24.14 Q5.3
Q6D
  Top 0.25: C22.1 R20.1 43.38,37.97 43.38,37.39 42.95,36.96 Q6.1
Q7D
  Top 0.25: Q7.1 72.95,63.3 73.86,64.21 75.66,64.21 C28.1
  Top 0.406: RV7.P$1 75.76,64.31 C28.1
Q7G
  Top 0.25: R23.2 R22.1 71.35,58.04 71.93,58.62 71.93,59.33 Q7.2
Q8D
  Top 0.25: Q8.1 Q7.3
Q8G
  Top 0.25: C24.2 66.9,59.5 Q8.2
Q8S
  Top 0.25: 66.05,62.07 66.05,61.89 Q8.3
  Top 0.406: R27.2 65.84,63.98 65.84,65.33 67.16,66.65 70.51,66.65 77.36,73.5 SW2.1
  Top 0.61: 66.05,61.89 65.89,62.05 R27.2
Q9D
  Top 0.406: 79.96,56.39 RV7.P$4 79.96,54.86 81.69,53.14 83.41,53.14 84.5,52.05 84.5,45.5 82.13,43.13 C27.1 75.78,43.17 Q9.1
Q9G
  Top 0.25: R25.2 70.13,39.19 R24.1 71.93,40.89 Q9.2
Q10D
  Top 0.25: Q10.1 70.99,43.1 Q9.3
Q10G
  Top 0.25: C23.2 66.9,41 Q10.2
Q10S
  Top 0.25: Q10.3 66.05,43.6 R29.2
  Top 0.406: R29.2 63.7,46.05 63.7,47.75 64.72,48.77 76.77,48.77 SW1.1
Q10SC
  Top 0.406: C30.2 78,46 SW1.2
RL1
  Top 0.25: R9.1 26.72,36.07 26.72,37.29 26.5,37.51 VR1.2 26.5,40.66 25.4,41.76 25.4,43.7 VR1.1
RL2
  Top 0.25: VR2.1 31.39,43.71 31.39,41.76 32.5,40.65 VR2.2 32.51,38.24 32.51,37.39 30.35,35.23 R10.1
TBT
  Top 0.406: RV4.P$3 48.4,8 C17.2
VCC  (via drill 0.5)
  Top 0.305: 111.5,36.79 TP8.TP 111.5,37.86 112.16,38.51 112.16,41.07 U2.7 112.17,38.6 112.13,38.56 | v111.5,35.64 110.62,34.77 C31.1 110.65,32.98 R33.2
  Top 0.406: 110.61,29.17 110.61,32.98 C31.1 110.73,33.1 110.61,33.23 110.61,34.76 v111.5,35.64 111.5,36.79 | TP8.TP 111.5,37.8 112.13,38.44 112.13,38.56 | R52.2 v120.79,41
  Bottom 1.016: v120.79,41 117.72,40.98 116.83,40.98 v111.5,35.64
VCC3
  Top 0.25: U5.5 48.04,72.36 R51.2 TP20.TP R50.1

### Text on the board
_tsilk: R48 | C63 | L3 | L4 | U5 | R49 | C59 | LSP2 | V1 | TP22 | R47 | TP20 | C64 | R51 | R50 | 1 | RV7 | LSP4 | U1 | R54 | R45 | R27 | C29 | C28 | R26 | C24 | C46 | C26 | C48 | R46 | C49 | C47 | R38 | Q8 | Q7 | C25 | L1 | R23 | R28 | R39 | L2 | C4 | R22 | C43 | LED2 | LED1 | RV3 | C2 | R6 | C44 | C37 | C41 | RV2 | R29 | TP3 | TP5 | C65 | R11 | U2 | C39 | C42 | TP4 | TP21 | R12 | C30 | TP10 | C27 | R8 | R56 | C10 | LSP3 | C9 | R7 | R57 | C11 | R30 | TP13 | C8 | C23 | Q10 | R25 | TP1 | C6 | VR1 | VR2 | C22 | Q9 | R32 | R53 | C5 | TP8 | R9 | C52 | R24 | R4 | C13 | R20 | TP11 | R55 | TP15 | C51 | C50 | C35 | C32 | R3 | C7 | R42 | C1 | LSP1 | R21 | Q6 | C53 | RV8 | C54 | R40 | U3 | C31 | Q2 | R10 | R31 | Q1 | TP12 | C38 | C14 | C12 | R41 | R33 | TP2 | R14 | R13 | Q4 | C21 | U4 | TP9 | TP14 | C33 | R1 | R15 | R43 | R5 | R2 | R18 | R44 | TP17 | TP16 | R35 | C45 | R34 | C16 | C3 | C34 | R36 | R37 | Q3 | Q5 | TP6 | FB1 | RV1 | R16 | R19 | C56 | C55 | RV10 | C18 | C20 | TP7 | C15 | C19 | R17 | RV9 | C17 | TP19 | TP18 | RV5 | RV6 | RV4
_bsilk: C57 | C58 | J5 | J3 | C36 | C40 | JP2 | JP1 | J1 | J2 | J4